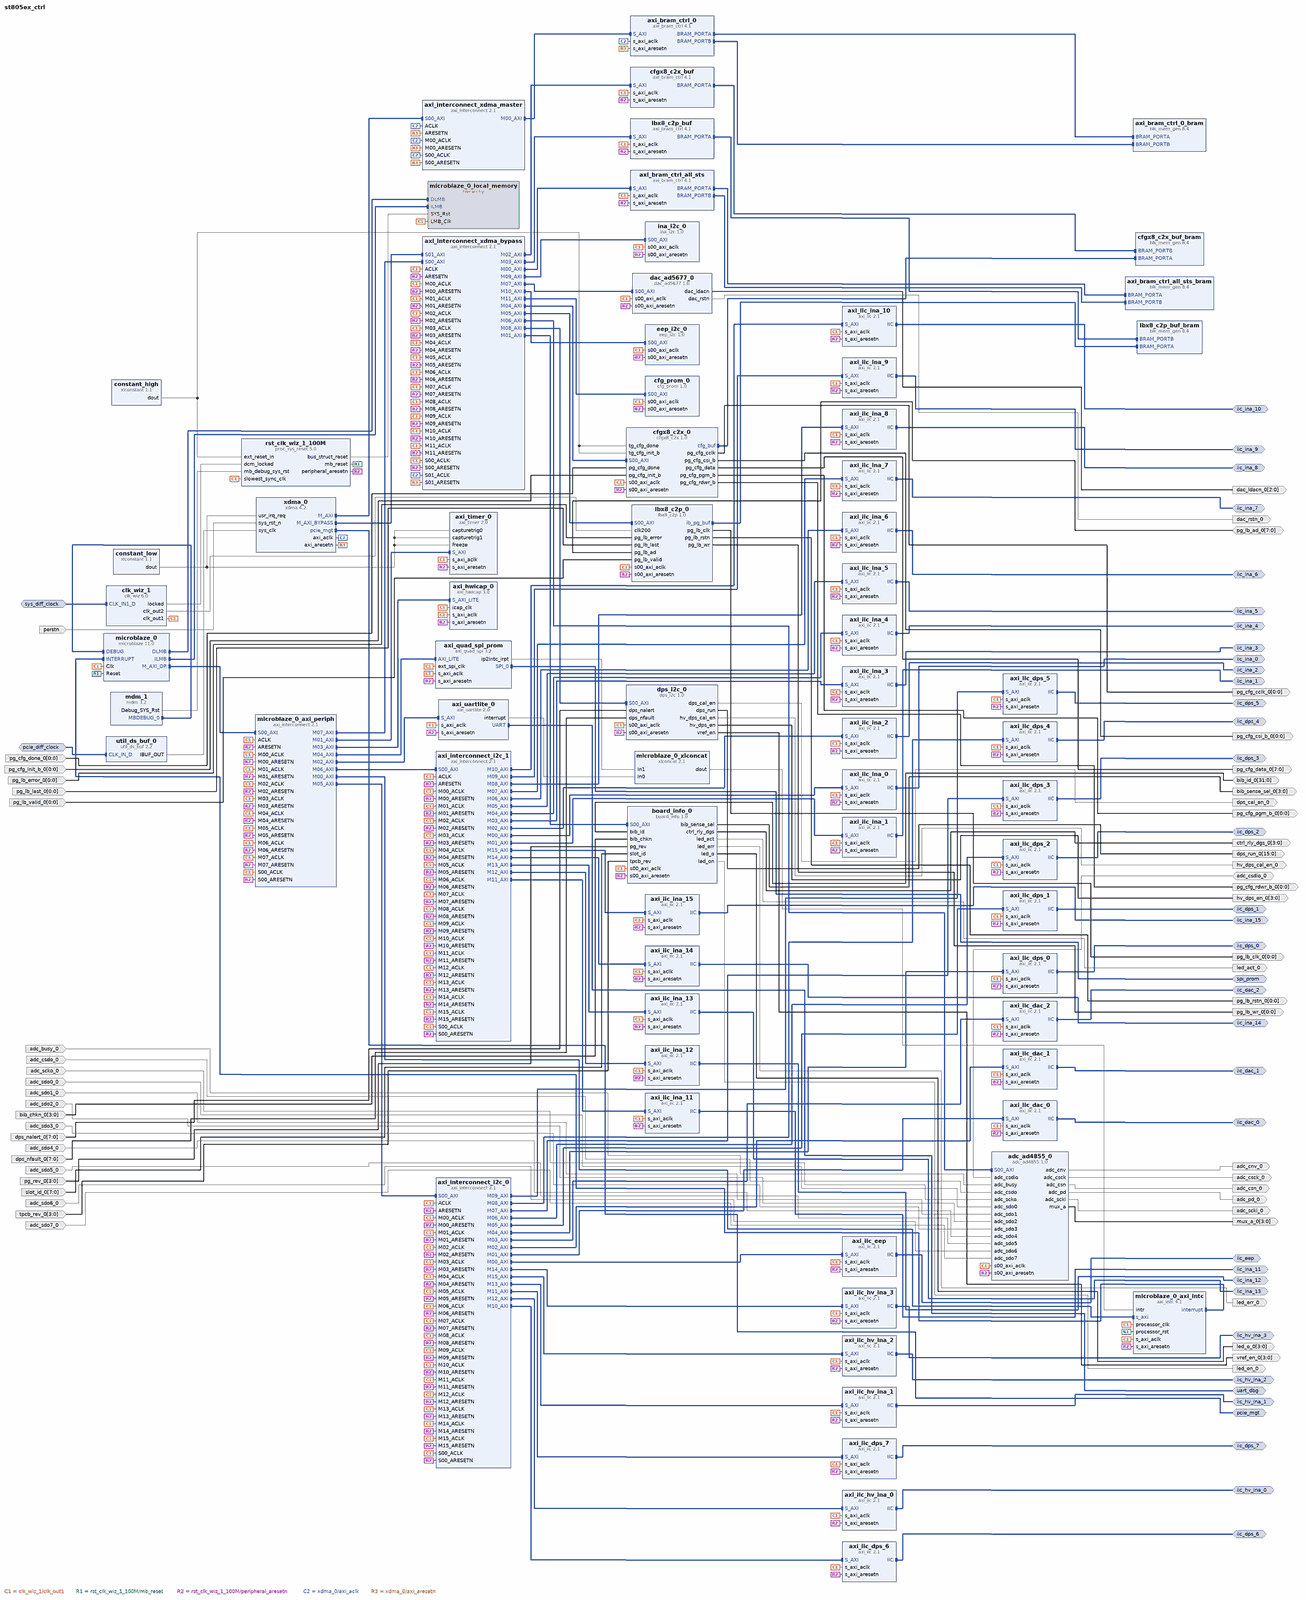
[diagram p0: block diagram of the top level, whole]
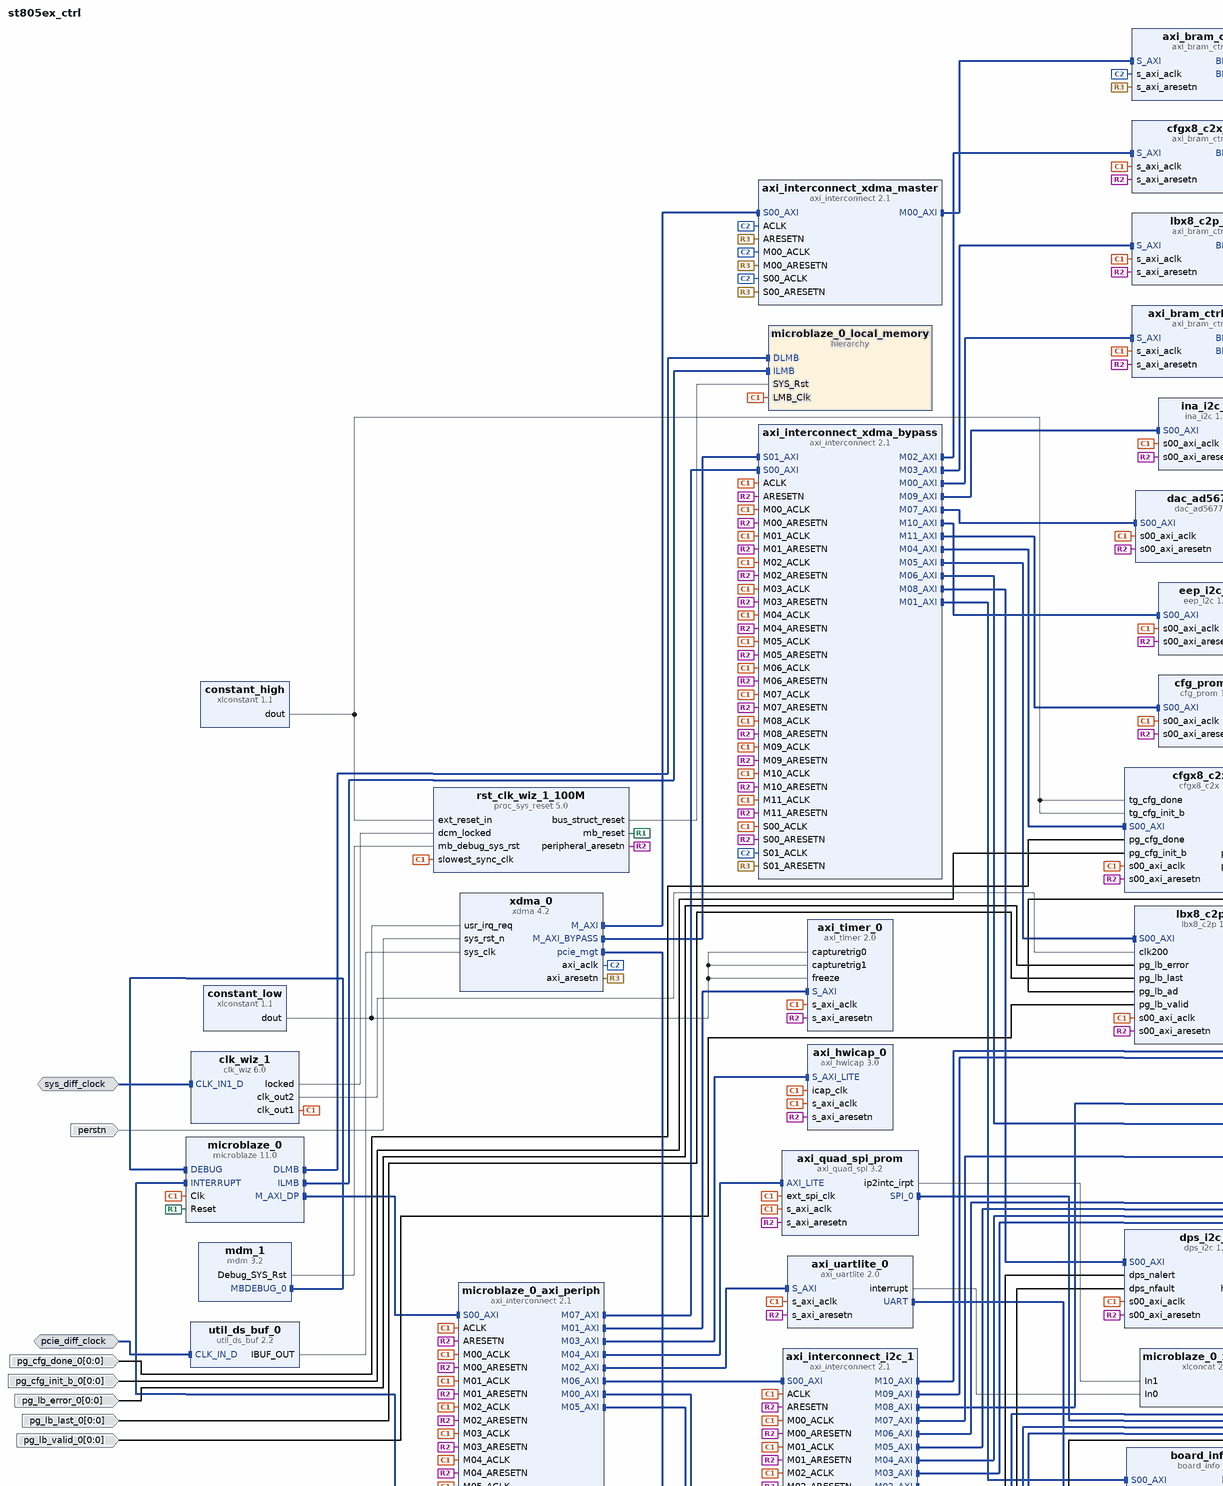
[diagram p1: block diagram of the top level, upper left part]
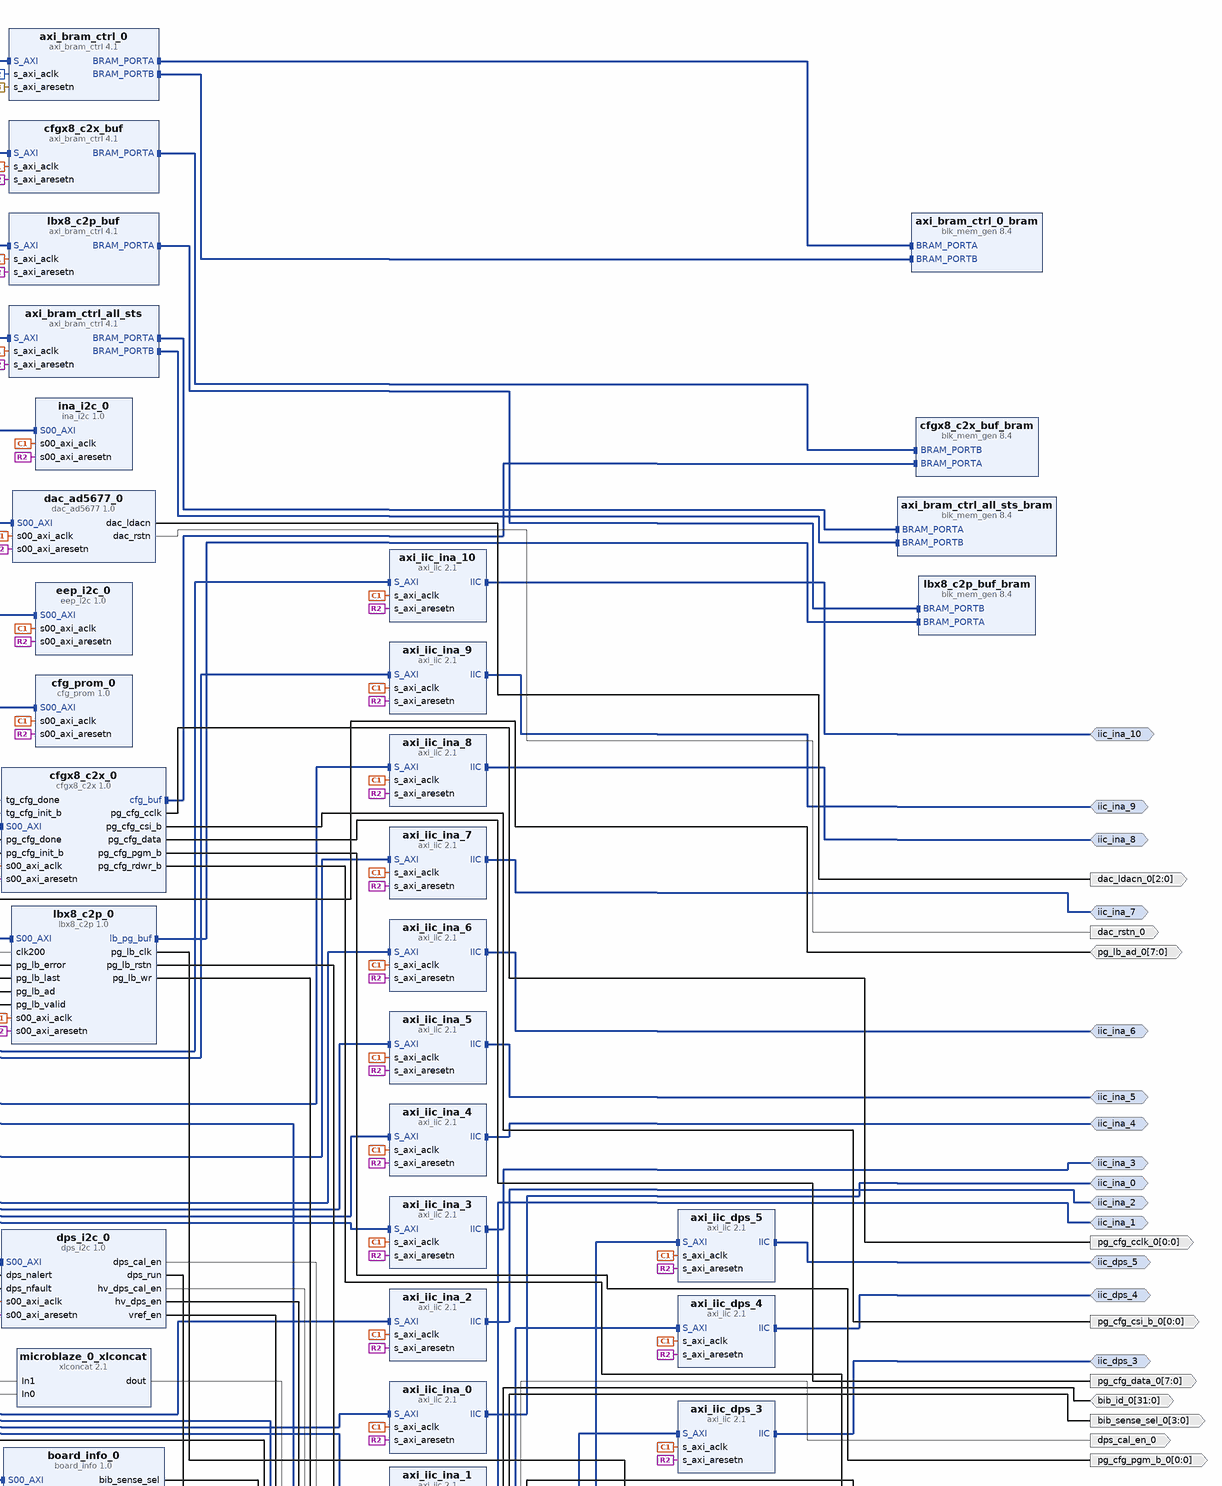
[diagram p2: block diagram of the top level, upper right part]
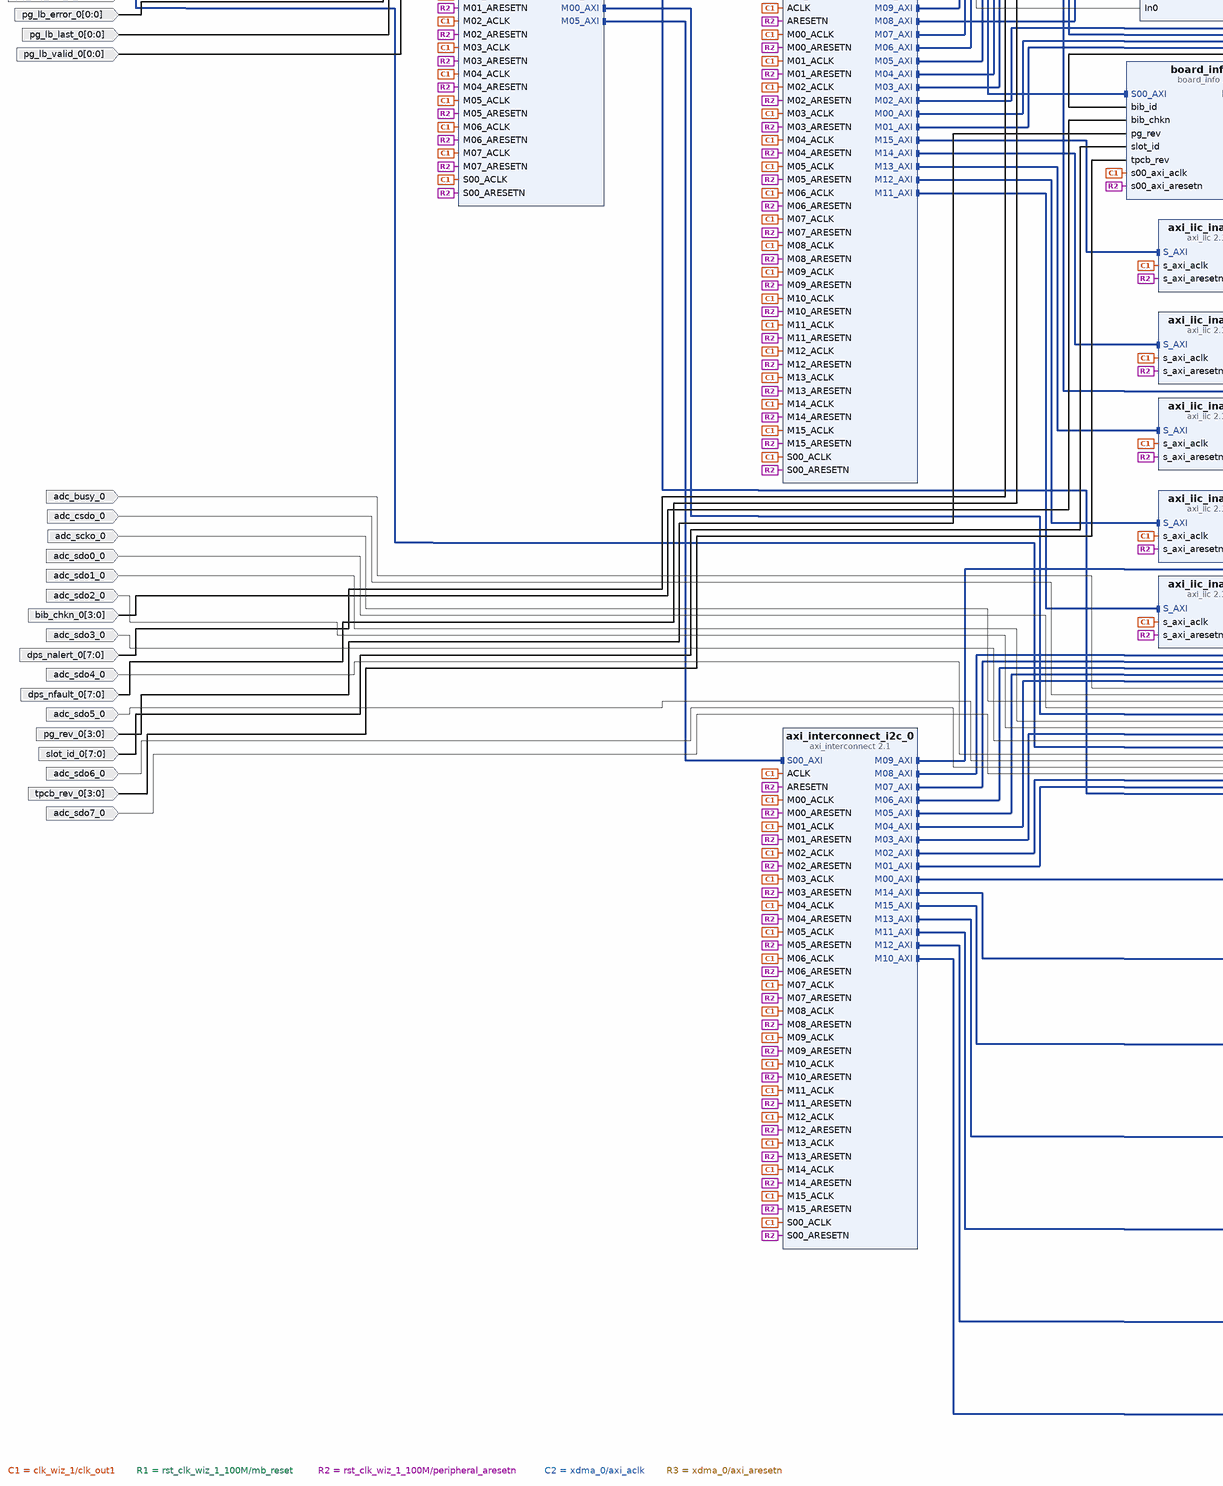
[diagram p3: block diagram of the top level, lower left part]
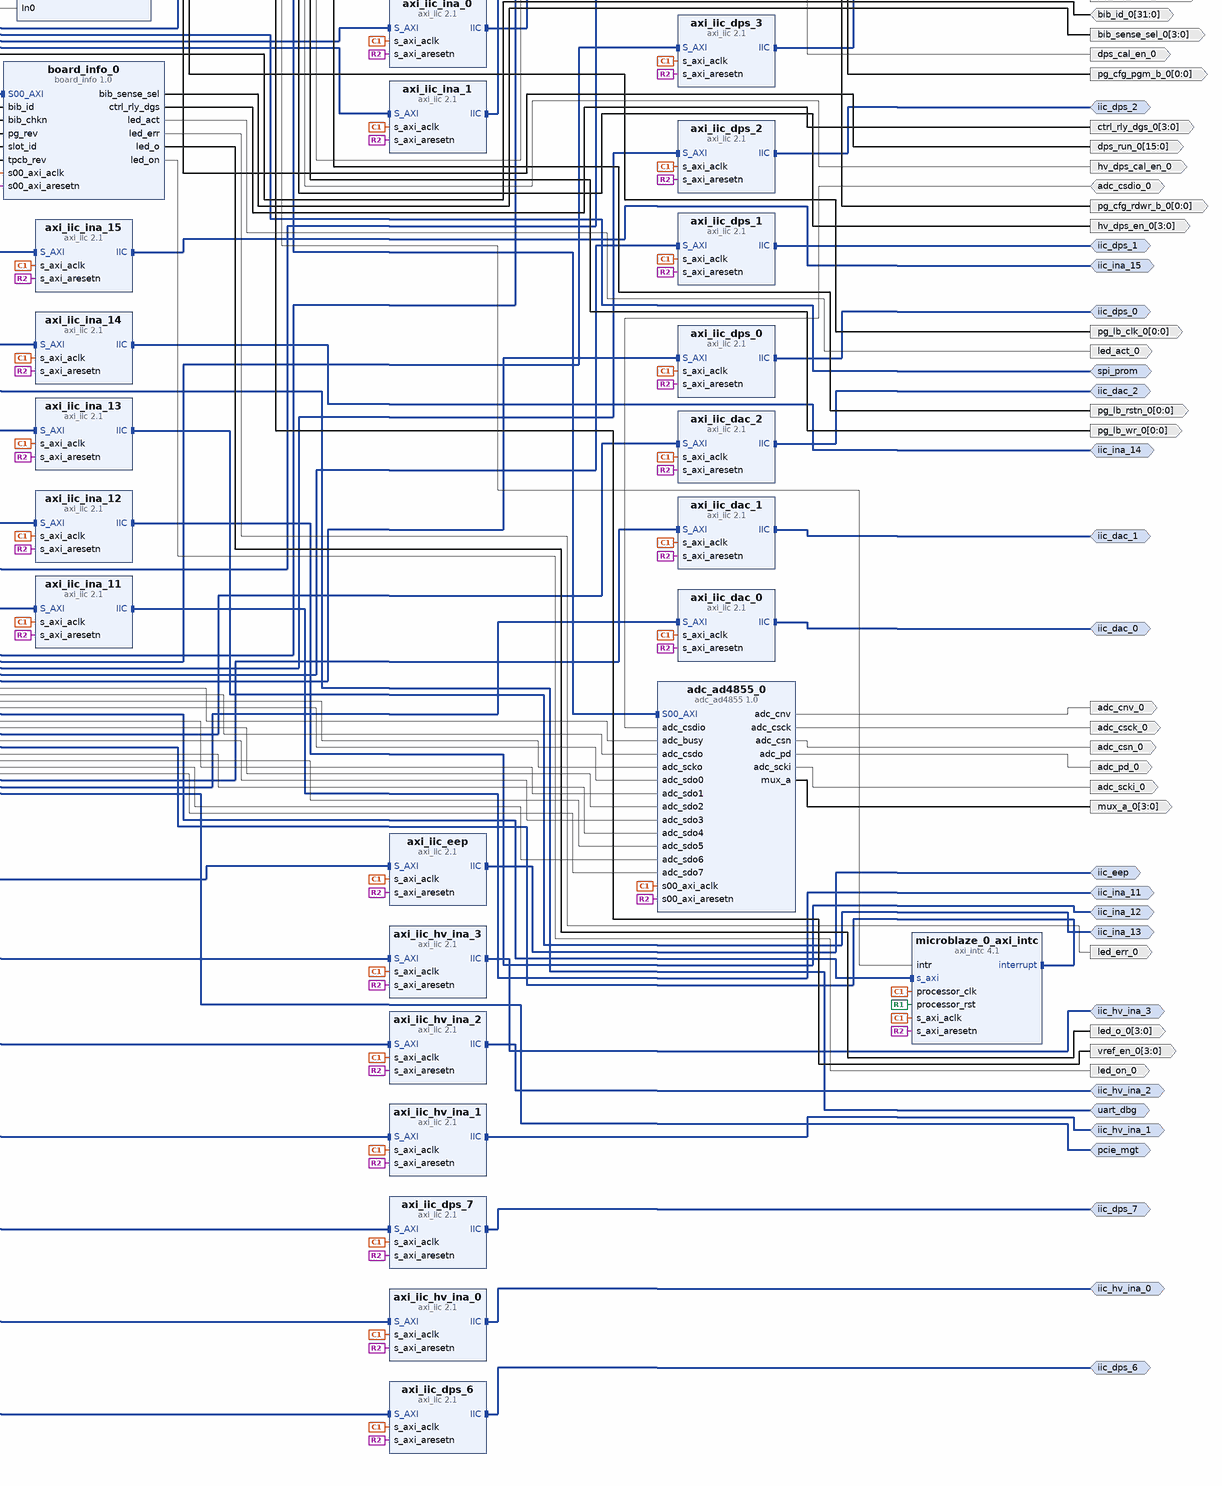
[diagram p4: block diagram of the top level, lower right part]
# Vivado block design st805ex_ctrl, xc7a200tffg1156-2, Vivado 2025.2
create_bd_design st805ex_ctrl

create_bd_intf_port -mode Slave -vlnv xilinx.com:interface:diff_clock_rtl:1.0 sys_diff_clock
create_bd_intf_port -mode Master -vlnv xilinx.com:interface:uart_rtl:1.0 uart_dbg
create_bd_intf_port -mode Master -vlnv xilinx.com:interface:spi_rtl:1.0 spi_prom
create_bd_intf_port -mode Master -vlnv xilinx.com:interface:iic_rtl:1.0 iic_dac_0
create_bd_intf_port -mode Master -vlnv xilinx.com:interface:iic_rtl:1.0 iic_dac_1
create_bd_intf_port -mode Master -vlnv xilinx.com:interface:iic_rtl:1.0 iic_dac_2
create_bd_intf_port -mode Master -vlnv xilinx.com:interface:iic_rtl:1.0 iic_eep
create_bd_intf_port -mode Master -vlnv xilinx.com:interface:iic_rtl:1.0 iic_dps_0
create_bd_intf_port -mode Master -vlnv xilinx.com:interface:iic_rtl:1.0 iic_dps_1
create_bd_intf_port -mode Master -vlnv xilinx.com:interface:iic_rtl:1.0 iic_dps_2
create_bd_intf_port -mode Master -vlnv xilinx.com:interface:iic_rtl:1.0 iic_dps_3
create_bd_intf_port -mode Master -vlnv xilinx.com:interface:iic_rtl:1.0 iic_dps_4
create_bd_intf_port -mode Master -vlnv xilinx.com:interface:iic_rtl:1.0 iic_dps_5
create_bd_intf_port -mode Master -vlnv xilinx.com:interface:iic_rtl:1.0 iic_dps_6
create_bd_intf_port -mode Master -vlnv xilinx.com:interface:iic_rtl:1.0 iic_dps_7
create_bd_intf_port -mode Master -vlnv xilinx.com:interface:iic_rtl:1.0 iic_hv_ina_0
create_bd_intf_port -mode Master -vlnv xilinx.com:interface:iic_rtl:1.0 iic_hv_ina_1
create_bd_intf_port -mode Master -vlnv xilinx.com:interface:iic_rtl:1.0 iic_hv_ina_2
create_bd_intf_port -mode Master -vlnv xilinx.com:interface:iic_rtl:1.0 iic_hv_ina_3
create_bd_intf_port -mode Master -vlnv xilinx.com:interface:iic_rtl:1.0 iic_ina_0
create_bd_intf_port -mode Master -vlnv xilinx.com:interface:iic_rtl:1.0 iic_ina_1
create_bd_intf_port -mode Master -vlnv xilinx.com:interface:iic_rtl:1.0 iic_ina_2
create_bd_intf_port -mode Master -vlnv xilinx.com:interface:iic_rtl:1.0 iic_ina_3
create_bd_intf_port -mode Master -vlnv xilinx.com:interface:iic_rtl:1.0 iic_ina_4
create_bd_intf_port -mode Master -vlnv xilinx.com:interface:iic_rtl:1.0 iic_ina_5
create_bd_intf_port -mode Master -vlnv xilinx.com:interface:iic_rtl:1.0 iic_ina_6
create_bd_intf_port -mode Master -vlnv xilinx.com:interface:iic_rtl:1.0 iic_ina_7
create_bd_intf_port -mode Master -vlnv xilinx.com:interface:iic_rtl:1.0 iic_ina_8
create_bd_intf_port -mode Master -vlnv xilinx.com:interface:iic_rtl:1.0 iic_ina_9
create_bd_intf_port -mode Master -vlnv xilinx.com:interface:iic_rtl:1.0 iic_ina_10
create_bd_intf_port -mode Master -vlnv xilinx.com:interface:iic_rtl:1.0 iic_ina_11
create_bd_intf_port -mode Master -vlnv xilinx.com:interface:iic_rtl:1.0 iic_ina_12
create_bd_intf_port -mode Master -vlnv xilinx.com:interface:iic_rtl:1.0 iic_ina_13
create_bd_intf_port -mode Master -vlnv xilinx.com:interface:iic_rtl:1.0 iic_ina_14
create_bd_intf_port -mode Master -vlnv xilinx.com:interface:iic_rtl:1.0 iic_ina_15
create_bd_intf_port -mode Slave -vlnv xilinx.com:interface:diff_clock_rtl:1.0 pcie_diff_clock
create_bd_intf_port -mode Master -vlnv xilinx.com:interface:pcie_7x_mgt_rtl:1.0 pcie_mgt
create_bd_port -dir I -type rst perstn
create_bd_port -dir I -from 3 -to 0 bib_chkn_0
create_bd_port -dir O -from 3 -to 0 bib_sense_sel_0
create_bd_port -dir O -from 3 -to 0 ctrl_rly_dgs_0
create_bd_port -dir O led_act_0
create_bd_port -dir O led_err_0
create_bd_port -dir O -from 3 -to 0 led_o_0
create_bd_port -dir O led_on_0
create_bd_port -dir I -from 7 -to 0 slot_id_0
create_bd_port -dir I -from 3 -to 0 tpcb_rev_0
create_bd_port -dir IO -from 31 -to 0 bib_id_0
create_bd_port -dir I -from 0 -to 0 pg_cfg_init_b_0
create_bd_port -dir I -from 0 -to 0 pg_cfg_done_0
create_bd_port -dir O -from 0 -to 0 pg_cfg_rdwr_b_0
create_bd_port -dir O -from 0 -to 0 pg_cfg_cclk_0
create_bd_port -dir O -from 0 -to 0 pg_cfg_pgm_b_0
create_bd_port -dir O -from 0 -to 0 pg_cfg_csi_b_0
create_bd_port -dir O -from 7 -to 0 pg_cfg_data_0
create_bd_port -dir O -from 0 -to 0 -type clk pg_lb_clk_0
create_bd_port -dir O -from 0 -to 0 -type rst pg_lb_rstn_0
create_bd_port -dir I -from 0 -to 0 pg_lb_last_0
create_bd_port -dir I -from 0 -to 0 pg_lb_valid_0
create_bd_port -dir I -from 0 -to 0 pg_lb_error_0
create_bd_port -dir O -from 0 -to 0 pg_lb_wr_0
create_bd_port -dir IO -from 7 -to 0 pg_lb_ad_0
create_bd_port -dir I adc_busy_0
create_bd_port -dir O adc_cnv_0
create_bd_port -dir O adc_csck_0
create_bd_port -dir IO adc_csdio_0
create_bd_port -dir I adc_csdo_0
create_bd_port -dir O adc_csn_0
create_bd_port -dir O adc_pd_0
create_bd_port -dir O adc_scki_0
create_bd_port -dir I adc_scko_0
create_bd_port -dir I adc_sdo0_0
create_bd_port -dir I adc_sdo1_0
create_bd_port -dir I adc_sdo2_0
create_bd_port -dir I adc_sdo3_0
create_bd_port -dir I adc_sdo4_0
create_bd_port -dir I adc_sdo5_0
create_bd_port -dir I adc_sdo6_0
create_bd_port -dir I adc_sdo7_0
create_bd_port -dir O -from 3 -to 0 mux_a_0
create_bd_port -dir O -type rst dac_rstn_0
create_bd_port -dir O -from 2 -to 0 dac_ldacn_0
create_bd_port -dir O dps_cal_en_0
create_bd_port -dir I -from 7 -to 0 dps_nalert_0
create_bd_port -dir I -from 7 -to 0 dps_nfault_0
create_bd_port -dir O -from 15 -to 0 dps_run_0
create_bd_port -dir O hv_dps_cal_en_0
create_bd_port -dir O -from 3 -to 0 hv_dps_en_0
create_bd_port -dir O -from 3 -to 0 vref_en_0
create_bd_port -dir I -from 3 -to 0 pg_rev_0

create_bd_cell -type ip -vlnv xilinx.com:ip:microblaze:11.0 microblaze_0
set_property -dict [list \
  CONFIG.C_DEBUG_ENABLED 1 \
  CONFIG.C_D_AXI 1 \
  CONFIG.C_D_LMB 1 \
  CONFIG.C_ENABLE_CONVERSION 0 \
  CONFIG.C_I_LMB 1 \
] [get_bd_cells microblaze_0]
create_bd_cell -type hier microblaze_0_local_memory
create_bd_cell -type ip -vlnv xilinx.com:ip:axi_interconnect:2.1 microblaze_0_axi_periph
set_property -dict {CONFIG.NUM_MI 8 CONFIG.S00_HAS_DATA_FIFO 2 CONFIG.STRATEGY 2} [get_bd_cells microblaze_0_axi_periph]
create_bd_cell -type ip -vlnv xilinx.com:ip:axi_intc:4.1 microblaze_0_axi_intc
set_property -dict {CONFIG.C_HAS_FAST 1} [get_bd_cells microblaze_0_axi_intc]
create_bd_cell -type ip -vlnv xilinx.com:ip:xlconcat:2.1 microblaze_0_xlconcat
create_bd_cell -type ip -vlnv xilinx.com:ip:mdm:3.2 mdm_1
create_bd_cell -type ip -vlnv xilinx.com:ip:clk_wiz:6.0 clk_wiz_1
set_property -dict [list \
  CONFIG.CLKOUT1_DRIVES BUFG \
  CONFIG.CLKOUT1_JITTER 130.958 \
  CONFIG.CLKOUT1_PHASE_ERROR 98.575 \
  CONFIG.CLKOUT2_DRIVES BUFG \
  CONFIG.CLKOUT2_JITTER 114.829 \
  CONFIG.CLKOUT2_PHASE_ERROR 98.575 \
  CONFIG.CLKOUT2_REQUESTED_OUT_FREQ 200.000 \
  CONFIG.CLKOUT2_USED true \
  CONFIG.CLKOUT3_DRIVES BUFG \
  CONFIG.CLKOUT4_DRIVES BUFG \
  CONFIG.CLKOUT5_DRIVES BUFG \
  CONFIG.CLKOUT6_DRIVES BUFG \
  CONFIG.CLKOUT7_DRIVES BUFG \
  CONFIG.MMCM_BANDWIDTH OPTIMIZED \
  CONFIG.MMCM_CLKFBOUT_MULT_F 10 \
  CONFIG.MMCM_CLKOUT0_DIVIDE_F 10 \
  CONFIG.MMCM_CLKOUT1_DIVIDE 5 \
  CONFIG.MMCM_COMPENSATION ZHOLD \
  CONFIG.NUM_OUT_CLKS 2 \
  CONFIG.PRIMITIVE PLL \
  CONFIG.PRIM_IN_FREQ 100.000 \
  CONFIG.PRIM_SOURCE Differential_clock_capable_pin \
  CONFIG.USE_RESET false \
] [get_bd_cells clk_wiz_1]
create_bd_cell -type ip -vlnv xilinx.com:ip:proc_sys_reset:5.0 rst_clk_wiz_1_100M
create_bd_cell -type ip -vlnv xilinx.com:ip:xlconstant:1.1 constant_high
create_bd_cell -type ip -vlnv xilinx.com:ip:axi_uartlite:2.0 axi_uartlite_0
set_property -dict {CONFIG.C_BAUDRATE 115200} [get_bd_cells axi_uartlite_0]
create_bd_cell -type ip -vlnv xilinx.com:ip:axi_timer:2.0 axi_timer_0
create_bd_cell -type ip -vlnv xilinx.com:ip:xlconstant:1.1 constant_low
set_property -dict {CONFIG.CONST_VAL 0} [get_bd_cells constant_low]
create_bd_cell -type ip -vlnv xilinx.com:ip:axi_hwicap:3.0 axi_hwicap_0
create_bd_cell -type ip -vlnv xilinx.com:ip:axi_quad_spi:3.2 axi_quad_spi_prom
set_property -dict {CONFIG.C_FIFO_DEPTH 256 CONFIG.C_SPI_MEMORY 2 CONFIG.C_SPI_MODE 2} [get_bd_cells axi_quad_spi_prom]
create_bd_cell -type ip -vlnv xilinx.com:ip:axi_interconnect:2.1 axi_interconnect_i2c_0
set_property -dict {CONFIG.NUM_MI 16 CONFIG.S00_HAS_DATA_FIFO 2 CONFIG.STRATEGY 2} [get_bd_cells axi_interconnect_i2c_0]
create_bd_cell -type ip -vlnv xilinx.com:ip:axi_iic:2.1 axi_iic_dac_0
set_property -dict [list \
  CONFIG.C_SCL_INERTIAL_DELAY 5 \
  CONFIG.C_SDA_INERTIAL_DELAY 5 \
  CONFIG.IIC_FREQ_KHZ 400 \
] [get_bd_cells axi_iic_dac_0]
create_bd_cell -type ip -vlnv xilinx.com:ip:axi_iic:2.1 axi_iic_dac_1
set_property -dict [list \
  CONFIG.C_SCL_INERTIAL_DELAY 5 \
  CONFIG.C_SDA_INERTIAL_DELAY 5 \
  CONFIG.IIC_FREQ_KHZ 400 \
] [get_bd_cells axi_iic_dac_1]
create_bd_cell -type ip -vlnv xilinx.com:ip:axi_iic:2.1 axi_iic_dac_2
set_property -dict [list \
  CONFIG.C_SCL_INERTIAL_DELAY 5 \
  CONFIG.C_SDA_INERTIAL_DELAY 5 \
  CONFIG.IIC_FREQ_KHZ 400 \
] [get_bd_cells axi_iic_dac_2]
create_bd_cell -type ip -vlnv xilinx.com:ip:axi_iic:2.1 axi_iic_eep
set_property -dict [list \
  CONFIG.C_SCL_INERTIAL_DELAY 5 \
  CONFIG.C_SDA_INERTIAL_DELAY 5 \
  CONFIG.IIC_FREQ_KHZ 400 \
] [get_bd_cells axi_iic_eep]
create_bd_cell -type ip -vlnv xilinx.com:ip:axi_iic:2.1 axi_iic_dps_0
set_property -dict [list \
  CONFIG.C_SCL_INERTIAL_DELAY 5 \
  CONFIG.C_SDA_INERTIAL_DELAY 5 \
  CONFIG.IIC_FREQ_KHZ 400 \
] [get_bd_cells axi_iic_dps_0]
create_bd_cell -type ip -vlnv xilinx.com:ip:axi_iic:2.1 axi_iic_dps_1
set_property -dict [list \
  CONFIG.C_SCL_INERTIAL_DELAY 5 \
  CONFIG.C_SDA_INERTIAL_DELAY 5 \
  CONFIG.IIC_FREQ_KHZ 400 \
] [get_bd_cells axi_iic_dps_1]
create_bd_cell -type ip -vlnv xilinx.com:ip:axi_iic:2.1 axi_iic_dps_2
set_property -dict [list \
  CONFIG.C_SCL_INERTIAL_DELAY 5 \
  CONFIG.C_SDA_INERTIAL_DELAY 5 \
  CONFIG.IIC_FREQ_KHZ 400 \
] [get_bd_cells axi_iic_dps_2]
create_bd_cell -type ip -vlnv xilinx.com:ip:axi_iic:2.1 axi_iic_dps_3
set_property -dict [list \
  CONFIG.C_SCL_INERTIAL_DELAY 5 \
  CONFIG.C_SDA_INERTIAL_DELAY 5 \
  CONFIG.IIC_FREQ_KHZ 400 \
] [get_bd_cells axi_iic_dps_3]
create_bd_cell -type ip -vlnv xilinx.com:ip:axi_iic:2.1 axi_iic_dps_4
set_property -dict [list \
  CONFIG.C_SCL_INERTIAL_DELAY 5 \
  CONFIG.C_SDA_INERTIAL_DELAY 5 \
  CONFIG.IIC_FREQ_KHZ 400 \
] [get_bd_cells axi_iic_dps_4]
create_bd_cell -type ip -vlnv xilinx.com:ip:axi_iic:2.1 axi_iic_dps_5
set_property -dict [list \
  CONFIG.C_SCL_INERTIAL_DELAY 5 \
  CONFIG.C_SDA_INERTIAL_DELAY 5 \
  CONFIG.IIC_FREQ_KHZ 400 \
] [get_bd_cells axi_iic_dps_5]
create_bd_cell -type ip -vlnv xilinx.com:ip:axi_iic:2.1 axi_iic_dps_6
set_property -dict [list \
  CONFIG.C_SCL_INERTIAL_DELAY 5 \
  CONFIG.C_SDA_INERTIAL_DELAY 5 \
  CONFIG.IIC_FREQ_KHZ 400 \
] [get_bd_cells axi_iic_dps_6]
create_bd_cell -type ip -vlnv xilinx.com:ip:axi_iic:2.1 axi_iic_dps_7
set_property -dict [list \
  CONFIG.C_SCL_INERTIAL_DELAY 5 \
  CONFIG.C_SDA_INERTIAL_DELAY 5 \
  CONFIG.IIC_FREQ_KHZ 400 \
] [get_bd_cells axi_iic_dps_7]
create_bd_cell -type ip -vlnv xilinx.com:ip:axi_iic:2.1 axi_iic_hv_ina_0
set_property -dict [list \
  CONFIG.C_SCL_INERTIAL_DELAY 5 \
  CONFIG.C_SDA_INERTIAL_DELAY 5 \
  CONFIG.IIC_FREQ_KHZ 400 \
] [get_bd_cells axi_iic_hv_ina_0]
create_bd_cell -type ip -vlnv xilinx.com:ip:axi_iic:2.1 axi_iic_hv_ina_1
set_property -dict [list \
  CONFIG.C_SCL_INERTIAL_DELAY 5 \
  CONFIG.C_SDA_INERTIAL_DELAY 5 \
  CONFIG.IIC_FREQ_KHZ 400 \
] [get_bd_cells axi_iic_hv_ina_1]
create_bd_cell -type ip -vlnv xilinx.com:ip:axi_iic:2.1 axi_iic_hv_ina_2
set_property -dict [list \
  CONFIG.C_SCL_INERTIAL_DELAY 5 \
  CONFIG.C_SDA_INERTIAL_DELAY 5 \
  CONFIG.IIC_FREQ_KHZ 400 \
] [get_bd_cells axi_iic_hv_ina_2]
create_bd_cell -type ip -vlnv xilinx.com:ip:axi_iic:2.1 axi_iic_hv_ina_3
set_property -dict [list \
  CONFIG.C_SCL_INERTIAL_DELAY 5 \
  CONFIG.C_SDA_INERTIAL_DELAY 5 \
  CONFIG.IIC_FREQ_KHZ 400 \
] [get_bd_cells axi_iic_hv_ina_3]
create_bd_cell -type ip -vlnv xilinx.com:ip:axi_interconnect:2.1 axi_interconnect_i2c_1
set_property -dict {CONFIG.NUM_MI 16 CONFIG.S00_HAS_DATA_FIFO 2 CONFIG.STRATEGY 2} [get_bd_cells axi_interconnect_i2c_1]
create_bd_cell -type ip -vlnv xilinx.com:ip:axi_iic:2.1 axi_iic_ina_0
set_property -dict [list \
  CONFIG.C_SCL_INERTIAL_DELAY 5 \
  CONFIG.C_SDA_INERTIAL_DELAY 5 \
  CONFIG.IIC_FREQ_KHZ 400 \
] [get_bd_cells axi_iic_ina_0]
create_bd_cell -type ip -vlnv xilinx.com:ip:axi_iic:2.1 axi_iic_ina_1
set_property -dict [list \
  CONFIG.C_SCL_INERTIAL_DELAY 5 \
  CONFIG.C_SDA_INERTIAL_DELAY 5 \
  CONFIG.IIC_FREQ_KHZ 400 \
] [get_bd_cells axi_iic_ina_1]
create_bd_cell -type ip -vlnv xilinx.com:ip:axi_iic:2.1 axi_iic_ina_2
set_property -dict [list \
  CONFIG.C_SCL_INERTIAL_DELAY 5 \
  CONFIG.C_SDA_INERTIAL_DELAY 5 \
  CONFIG.IIC_FREQ_KHZ 400 \
] [get_bd_cells axi_iic_ina_2]
create_bd_cell -type ip -vlnv xilinx.com:ip:axi_iic:2.1 axi_iic_ina_3
set_property -dict [list \
  CONFIG.C_SCL_INERTIAL_DELAY 5 \
  CONFIG.C_SDA_INERTIAL_DELAY 5 \
  CONFIG.IIC_FREQ_KHZ 400 \
] [get_bd_cells axi_iic_ina_3]
create_bd_cell -type ip -vlnv xilinx.com:ip:axi_iic:2.1 axi_iic_ina_4
set_property -dict [list \
  CONFIG.C_SCL_INERTIAL_DELAY 5 \
  CONFIG.C_SDA_INERTIAL_DELAY 5 \
  CONFIG.IIC_FREQ_KHZ 400 \
] [get_bd_cells axi_iic_ina_4]
create_bd_cell -type ip -vlnv xilinx.com:ip:axi_iic:2.1 axi_iic_ina_5
set_property -dict [list \
  CONFIG.C_SCL_INERTIAL_DELAY 5 \
  CONFIG.C_SDA_INERTIAL_DELAY 5 \
  CONFIG.IIC_FREQ_KHZ 400 \
] [get_bd_cells axi_iic_ina_5]
create_bd_cell -type ip -vlnv xilinx.com:ip:axi_iic:2.1 axi_iic_ina_6
set_property -dict [list \
  CONFIG.C_SCL_INERTIAL_DELAY 5 \
  CONFIG.C_SDA_INERTIAL_DELAY 5 \
  CONFIG.IIC_FREQ_KHZ 400 \
] [get_bd_cells axi_iic_ina_6]
create_bd_cell -type ip -vlnv xilinx.com:ip:axi_iic:2.1 axi_iic_ina_7
set_property -dict [list \
  CONFIG.C_SCL_INERTIAL_DELAY 5 \
  CONFIG.C_SDA_INERTIAL_DELAY 5 \
  CONFIG.IIC_FREQ_KHZ 400 \
] [get_bd_cells axi_iic_ina_7]
create_bd_cell -type ip -vlnv xilinx.com:ip:axi_iic:2.1 axi_iic_ina_8
set_property -dict [list \
  CONFIG.C_SCL_INERTIAL_DELAY 5 \
  CONFIG.C_SDA_INERTIAL_DELAY 5 \
  CONFIG.IIC_FREQ_KHZ 400 \
] [get_bd_cells axi_iic_ina_8]
create_bd_cell -type ip -vlnv xilinx.com:ip:axi_iic:2.1 axi_iic_ina_9
set_property -dict [list \
  CONFIG.C_SCL_INERTIAL_DELAY 5 \
  CONFIG.C_SDA_INERTIAL_DELAY 5 \
  CONFIG.IIC_FREQ_KHZ 400 \
] [get_bd_cells axi_iic_ina_9]
create_bd_cell -type ip -vlnv xilinx.com:ip:axi_iic:2.1 axi_iic_ina_10
set_property -dict [list \
  CONFIG.C_SCL_INERTIAL_DELAY 5 \
  CONFIG.C_SDA_INERTIAL_DELAY 5 \
  CONFIG.IIC_FREQ_KHZ 400 \
] [get_bd_cells axi_iic_ina_10]
create_bd_cell -type ip -vlnv xilinx.com:ip:axi_iic:2.1 axi_iic_ina_11
set_property -dict [list \
  CONFIG.C_SCL_INERTIAL_DELAY 5 \
  CONFIG.C_SDA_INERTIAL_DELAY 5 \
  CONFIG.IIC_FREQ_KHZ 400 \
] [get_bd_cells axi_iic_ina_11]
create_bd_cell -type ip -vlnv xilinx.com:ip:axi_iic:2.1 axi_iic_ina_12
set_property -dict [list \
  CONFIG.C_SCL_INERTIAL_DELAY 5 \
  CONFIG.C_SDA_INERTIAL_DELAY 5 \
  CONFIG.IIC_FREQ_KHZ 400 \
] [get_bd_cells axi_iic_ina_12]
create_bd_cell -type ip -vlnv xilinx.com:ip:axi_iic:2.1 axi_iic_ina_13
set_property -dict [list \
  CONFIG.C_SCL_INERTIAL_DELAY 5 \
  CONFIG.C_SDA_INERTIAL_DELAY 5 \
  CONFIG.IIC_FREQ_KHZ 400 \
] [get_bd_cells axi_iic_ina_13]
create_bd_cell -type ip -vlnv xilinx.com:ip:axi_iic:2.1 axi_iic_ina_14
set_property -dict [list \
  CONFIG.C_SCL_INERTIAL_DELAY 5 \
  CONFIG.C_SDA_INERTIAL_DELAY 5 \
  CONFIG.IIC_FREQ_KHZ 400 \
] [get_bd_cells axi_iic_ina_14]
create_bd_cell -type ip -vlnv xilinx.com:ip:axi_iic:2.1 axi_iic_ina_15
set_property -dict [list \
  CONFIG.C_SCL_INERTIAL_DELAY 5 \
  CONFIG.C_SDA_INERTIAL_DELAY 5 \
  CONFIG.IIC_FREQ_KHZ 400 \
] [get_bd_cells axi_iic_ina_15]
create_bd_cell -type ip -vlnv xilinx.com:ip:xdma:4.2 xdma_0
set_property -dict [list \
  CONFIG.PF0_DEVICE_ID_mqdma 9021 \
  CONFIG.PF2_DEVICE_ID_mqdma 9221 \
  CONFIG.PF3_DEVICE_ID_mqdma 9321 \
  CONFIG.Shared_Logic_Both_7xG2 true \
  CONFIG.axi_bypass_64bit_en true \
  CONFIG.axist_bypass_en true \
  CONFIG.axist_bypass_size 16 \
  CONFIG.axisten_freq 125 \
  CONFIG.cfg_mgmt_if false \
  CONFIG.enable_gtwizard false \
  CONFIG.mode_selection Advanced \
  CONFIG.pciebar2axibar_axist_bypass 0x00000000C0000000 \
  CONFIG.pf0_base_class_menu Memory_controller \
  CONFIG.pf0_class_code_base 05 \
  CONFIG.pf0_class_code_interface 00 \
  CONFIG.pf0_class_code_sub 80 \
  CONFIG.pf0_device_id 7021 \
  CONFIG.pf0_interrupt_pin NONE \
  CONFIG.pf0_msi_enabled false \
  CONFIG.pf0_sub_class_interface_menu Other_memory_controller \
  CONFIG.pl_link_cap_max_link_speed 5.0_GT/s \
  CONFIG.plltype QPLL1 \
  CONFIG.xdma_pcie_64bit_en true \
  CONFIG.xdma_rnum_chnl 2 \
  CONFIG.xdma_wnum_chnl 2 \
] [get_bd_cells xdma_0]
create_bd_cell -type ip -vlnv xilinx.com:ip:util_ds_buf:2.2 util_ds_buf_0
set_property -dict {CONFIG.C_BUF_TYPE IBUFDSGTE} [get_bd_cells util_ds_buf_0]
create_bd_cell -type ip -vlnv xilinx.com:ip:axi_interconnect:2.1 axi_interconnect_xdma_bypass
set_property -dict [list \
  CONFIG.NUM_MI 12 \
  CONFIG.NUM_SI 2 \
  CONFIG.S00_HAS_DATA_FIFO 2 \
  CONFIG.S01_HAS_DATA_FIFO 2 \
  CONFIG.STRATEGY 2 \
] [get_bd_cells axi_interconnect_xdma_bypass]
create_bd_cell -type ip -vlnv xilinx.com:ip:axi_interconnect:2.1 axi_interconnect_xdma_master
set_property -dict [list \
  CONFIG.NUM_MI 1 \
  CONFIG.NUM_SI 1 \
  CONFIG.S00_HAS_DATA_FIFO 2 \
  CONFIG.S01_HAS_DATA_FIFO 2 \
  CONFIG.STRATEGY 0 \
] [get_bd_cells axi_interconnect_xdma_master]
create_bd_cell -type ip -vlnv xilinx.com:ip:axi_bram_ctrl:4.1 axi_bram_ctrl_0
create_bd_cell -type ip -vlnv xilinx.com:ip:blk_mem_gen:8.4 axi_bram_ctrl_0_bram
set_property -dict [list \
  CONFIG.Enable_B Use_ENB_Pin \
  CONFIG.Memory_Type True_Dual_Port_RAM \
  CONFIG.Port_B_Clock 100 \
  CONFIG.Port_B_Enable_Rate 100 \
  CONFIG.Port_B_Write_Rate 50 \
  CONFIG.Use_RSTB_Pin true \
] [get_bd_cells axi_bram_ctrl_0_bram]
create_bd_cell -type ip -vlnv xilinx.com:user:board_info:1.0 board_info_0
create_bd_cell -type ip -vlnv xilinx.com:user:cfgx8_c2x:1.0 cfgx8_c2x_0
create_bd_cell -type ip -vlnv xilinx.com:ip:axi_bram_ctrl:4.1 cfgx8_c2x_buf
set_property -dict {CONFIG.SINGLE_PORT_BRAM 1} [get_bd_cells cfgx8_c2x_buf]
create_bd_cell -type ip -vlnv xilinx.com:ip:axi_bram_ctrl:4.1 lbx8_c2p_buf
set_property -dict {CONFIG.SINGLE_PORT_BRAM 1} [get_bd_cells lbx8_c2p_buf]
create_bd_cell -type ip -vlnv xilinx.com:ip:blk_mem_gen:8.4 cfgx8_c2x_buf_bram
set_property -dict [list \
  CONFIG.Enable_B Use_ENB_Pin \
  CONFIG.Memory_Type True_Dual_Port_RAM \
  CONFIG.Port_B_Clock 100 \
  CONFIG.Port_B_Enable_Rate 100 \
  CONFIG.Port_B_Write_Rate 50 \
  CONFIG.Use_RSTB_Pin true \
] [get_bd_cells cfgx8_c2x_buf_bram]
create_bd_cell -type ip -vlnv xilinx.com:ip:blk_mem_gen:8.4 lbx8_c2p_buf_bram
set_property -dict [list \
  CONFIG.Enable_B Use_ENB_Pin \
  CONFIG.Memory_Type True_Dual_Port_RAM \
  CONFIG.Port_B_Clock 100 \
  CONFIG.Port_B_Enable_Rate 100 \
  CONFIG.Port_B_Write_Rate 50 \
  CONFIG.Use_RSTB_Pin true \
] [get_bd_cells lbx8_c2p_buf_bram]
create_bd_cell -type ip -vlnv xilinx.com:user:lbx8_c2p:1.0 lbx8_c2p_0
create_bd_cell -type ip -vlnv xilinx.com:user:adc_ad4855:1.0 adc_ad4855_0
create_bd_cell -type ip -vlnv xilinx.com:user:dac_ad5677:1.0 dac_ad5677_0
create_bd_cell -type ip -vlnv xilinx.com:user:dps_i2c:1.0 dps_i2c_0
create_bd_cell -type ip -vlnv xilinx.com:user:ina_i2c:1.0 ina_i2c_0
create_bd_cell -type ip -vlnv xilinx.com:user:eep_i2c:1.0 eep_i2c_0
create_bd_cell -type ip -vlnv xilinx.com:user:cfg_prom:1.0 cfg_prom_0
create_bd_cell -type ip -vlnv xilinx.com:ip:axi_bram_ctrl:4.1 axi_bram_ctrl_all_sts
create_bd_cell -type ip -vlnv xilinx.com:ip:blk_mem_gen:8.4 axi_bram_ctrl_all_sts_bram
set_property -dict {CONFIG.Memory_Type True_Dual_Port_RAM} [get_bd_cells axi_bram_ctrl_all_sts_bram]

# ---- hierarchy /microblaze_0_local_memory ----
current_bd_instance /microblaze_0_local_memory
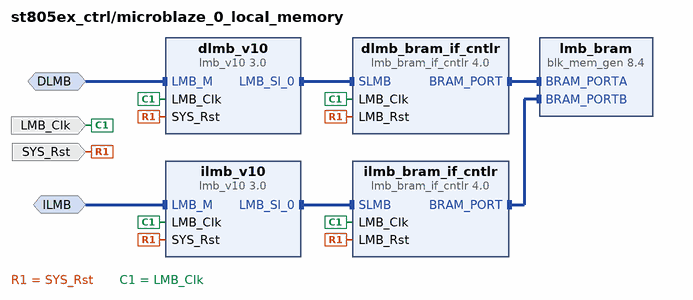
[diagram p5: block diagram inside /microblaze_0_local_memory]
create_bd_intf_pin -mode MirroredMaster -vlnv xilinx.com:interface:lmb_rtl:1.0 DLMB
create_bd_intf_pin -mode MirroredMaster -vlnv xilinx.com:interface:lmb_rtl:1.0 ILMB
create_bd_pin -dir I -type clk LMB_Clk
create_bd_pin -dir I -type rst SYS_Rst

create_bd_cell -type ip -vlnv xilinx.com:ip:lmb_v10:3.0 dlmb_v10
create_bd_cell -type ip -vlnv xilinx.com:ip:lmb_v10:3.0 ilmb_v10
create_bd_cell -type ip -vlnv xilinx.com:ip:lmb_bram_if_cntlr:4.0 dlmb_bram_if_cntlr
set_property -dict {CONFIG.C_ECC 0} [get_bd_cells dlmb_bram_if_cntlr]
create_bd_cell -type ip -vlnv xilinx.com:ip:lmb_bram_if_cntlr:4.0 ilmb_bram_if_cntlr
set_property -dict {CONFIG.C_ECC 0} [get_bd_cells ilmb_bram_if_cntlr]
create_bd_cell -type ip -vlnv xilinx.com:ip:blk_mem_gen:8.4 lmb_bram
set_property -dict [list \
  CONFIG.Enable_B Use_ENB_Pin \
  CONFIG.Memory_Type True_Dual_Port_RAM \
  CONFIG.Port_B_Clock 100 \
  CONFIG.Port_B_Enable_Rate 100 \
  CONFIG.Port_B_Write_Rate 50 \
  CONFIG.Use_RSTB_Pin true \
  CONFIG.use_bram_block BRAM_Controller \
] [get_bd_cells lmb_bram]

# ---- connections ----

current_bd_instance /microblaze_0_local_memory
connect_bd_intf_net -intf_net microblaze_0_dlmb [get_bd_intf_pins dlmb_v10/LMB_M] [get_bd_intf_pins DLMB]
connect_bd_intf_net -intf_net microblaze_0_dlmb_bus [get_bd_intf_pins dlmb_v10/LMB_Sl_0] [get_bd_intf_pins dlmb_bram_if_cntlr/SLMB]
connect_bd_intf_net -intf_net microblaze_0_dlmb_cntlr [get_bd_intf_pins dlmb_bram_if_cntlr/BRAM_PORT] [get_bd_intf_pins lmb_bram/BRAM_PORTA]
connect_bd_intf_net -intf_net microblaze_0_ilmb [get_bd_intf_pins ilmb_v10/LMB_M] [get_bd_intf_pins ILMB]
connect_bd_intf_net -intf_net microblaze_0_ilmb_bus [get_bd_intf_pins ilmb_v10/LMB_Sl_0] [get_bd_intf_pins ilmb_bram_if_cntlr/SLMB]
connect_bd_intf_net -intf_net microblaze_0_ilmb_cntlr [get_bd_intf_pins ilmb_bram_if_cntlr/BRAM_PORT] [get_bd_intf_pins lmb_bram/BRAM_PORTB]
connect_bd_net [get_bd_pins SYS_Rst] \
  [get_bd_pins dlmb_bram_if_cntlr/LMB_Rst] [get_bd_pins dlmb_v10/SYS_Rst] [get_bd_pins ilmb_bram_if_cntlr/LMB_Rst] \
  [get_bd_pins ilmb_v10/SYS_Rst]
connect_bd_net -net microblaze_0_Clk [get_bd_pins LMB_Clk] \
  [get_bd_pins dlmb_bram_if_cntlr/LMB_Clk] [get_bd_pins dlmb_v10/LMB_Clk] [get_bd_pins ilmb_bram_if_cntlr/LMB_Clk] \
  [get_bd_pins ilmb_v10/LMB_Clk]
set_property HDL_ATTRIBUTE.BMM_INFO_ADDRESS_SPACE {byte  0x00000000 32 > st805ex_ctrl microblaze_0_local_memory/lmb_bram} [get_bd_cells dlmb_bram_if_cntlr]
set_property HDL_ATTRIBUTE.KEEP_HIERARCHY yes [get_bd_cells dlmb_bram_if_cntlr]

current_bd_instance /
connect_bd_intf_net -intf_net CLK_IN1_D_0_1 [get_bd_intf_ports sys_diff_clock] [get_bd_intf_pins clk_wiz_1/CLK_IN1_D]
connect_bd_intf_net -intf_net CLK_IN_D_0_1 [get_bd_intf_ports pcie_diff_clock] [get_bd_intf_pins util_ds_buf_0/CLK_IN_D]
connect_bd_intf_net [get_bd_intf_pins axi_bram_ctrl_0_bram/BRAM_PORTA] [get_bd_intf_pins axi_bram_ctrl_0/BRAM_PORTA]
connect_bd_intf_net [get_bd_intf_pins axi_bram_ctrl_0_bram/BRAM_PORTB] [get_bd_intf_pins axi_bram_ctrl_0/BRAM_PORTB]
connect_bd_intf_net [get_bd_intf_pins axi_bram_ctrl_all_sts_bram/BRAM_PORTA] [get_bd_intf_pins axi_bram_ctrl_all_sts/BRAM_PORTA]
connect_bd_intf_net [get_bd_intf_pins axi_bram_ctrl_all_sts_bram/BRAM_PORTB] [get_bd_intf_pins axi_bram_ctrl_all_sts/BRAM_PORTB]
connect_bd_intf_net [get_bd_intf_ports iic_dac_0] [get_bd_intf_pins axi_iic_dac_0/IIC]
connect_bd_intf_net [get_bd_intf_ports iic_dac_1] [get_bd_intf_pins axi_iic_dac_1/IIC]
connect_bd_intf_net [get_bd_intf_ports iic_dac_2] [get_bd_intf_pins axi_iic_dac_2/IIC]
connect_bd_intf_net [get_bd_intf_ports iic_dps_0] [get_bd_intf_pins axi_iic_dps_0/IIC]
connect_bd_intf_net [get_bd_intf_ports iic_dps_1] [get_bd_intf_pins axi_iic_dps_1/IIC]
connect_bd_intf_net [get_bd_intf_ports iic_dps_2] [get_bd_intf_pins axi_iic_dps_2/IIC]
connect_bd_intf_net [get_bd_intf_ports iic_dps_3] [get_bd_intf_pins axi_iic_dps_3/IIC]
connect_bd_intf_net [get_bd_intf_ports iic_dps_4] [get_bd_intf_pins axi_iic_dps_4/IIC]
connect_bd_intf_net [get_bd_intf_ports iic_dps_5] [get_bd_intf_pins axi_iic_dps_5/IIC]
connect_bd_intf_net [get_bd_intf_ports iic_dps_6] [get_bd_intf_pins axi_iic_dps_6/IIC]
connect_bd_intf_net [get_bd_intf_ports iic_dps_7] [get_bd_intf_pins axi_iic_dps_7/IIC]
connect_bd_intf_net [get_bd_intf_ports iic_eep] [get_bd_intf_pins axi_iic_eep/IIC]
connect_bd_intf_net [get_bd_intf_ports iic_hv_ina_0] [get_bd_intf_pins axi_iic_hv_ina_0/IIC]
connect_bd_intf_net [get_bd_intf_ports iic_hv_ina_1] [get_bd_intf_pins axi_iic_hv_ina_1/IIC]
connect_bd_intf_net [get_bd_intf_ports iic_hv_ina_2] [get_bd_intf_pins axi_iic_hv_ina_2/IIC]
connect_bd_intf_net [get_bd_intf_ports iic_hv_ina_3] [get_bd_intf_pins axi_iic_hv_ina_3/IIC]
connect_bd_intf_net [get_bd_intf_ports iic_ina_0] [get_bd_intf_pins axi_iic_ina_0/IIC]
connect_bd_intf_net [get_bd_intf_ports iic_ina_10] [get_bd_intf_pins axi_iic_ina_10/IIC]
connect_bd_intf_net [get_bd_intf_ports iic_ina_11] [get_bd_intf_pins axi_iic_ina_11/IIC]
connect_bd_intf_net [get_bd_intf_ports iic_ina_12] [get_bd_intf_pins axi_iic_ina_12/IIC]
connect_bd_intf_net [get_bd_intf_ports iic_ina_13] [get_bd_intf_pins axi_iic_ina_13/IIC]
connect_bd_intf_net [get_bd_intf_ports iic_ina_14] [get_bd_intf_pins axi_iic_ina_14/IIC]
connect_bd_intf_net [get_bd_intf_ports iic_ina_15] [get_bd_intf_pins axi_iic_ina_15/IIC]
connect_bd_intf_net [get_bd_intf_ports iic_ina_1] [get_bd_intf_pins axi_iic_ina_1/IIC]
connect_bd_intf_net [get_bd_intf_ports iic_ina_2] [get_bd_intf_pins axi_iic_ina_2/IIC]
connect_bd_intf_net [get_bd_intf_ports iic_ina_3] [get_bd_intf_pins axi_iic_ina_3/IIC]
connect_bd_intf_net [get_bd_intf_ports iic_ina_4] [get_bd_intf_pins axi_iic_ina_4/IIC]
connect_bd_intf_net [get_bd_intf_ports iic_ina_5] [get_bd_intf_pins axi_iic_ina_5/IIC]
connect_bd_intf_net [get_bd_intf_ports iic_ina_6] [get_bd_intf_pins axi_iic_ina_6/IIC]
connect_bd_intf_net [get_bd_intf_ports iic_ina_7] [get_bd_intf_pins axi_iic_ina_7/IIC]
connect_bd_intf_net [get_bd_intf_ports iic_ina_8] [get_bd_intf_pins axi_iic_ina_8/IIC]
connect_bd_intf_net [get_bd_intf_ports iic_ina_9] [get_bd_intf_pins axi_iic_ina_9/IIC]
connect_bd_intf_net [get_bd_intf_pins axi_interconnect_i2c_1/M00_AXI] [get_bd_intf_pins axi_iic_ina_0/S_AXI]
connect_bd_intf_net [get_bd_intf_pins axi_interconnect_i2c_1/M01_AXI] [get_bd_intf_pins axi_iic_ina_1/S_AXI]
connect_bd_intf_net [get_bd_intf_pins axi_interconnect_i2c_1/M02_AXI] [get_bd_intf_pins axi_iic_ina_2/S_AXI]
connect_bd_intf_net [get_bd_intf_pins axi_interconnect_i2c_1/M03_AXI] [get_bd_intf_pins axi_iic_ina_3/S_AXI]
connect_bd_intf_net [get_bd_intf_pins axi_interconnect_i2c_1/M04_AXI] [get_bd_intf_pins axi_iic_ina_4/S_AXI]
connect_bd_intf_net [get_bd_intf_pins axi_interconnect_i2c_1/M05_AXI] [get_bd_intf_pins axi_iic_ina_5/S_AXI]
connect_bd_intf_net [get_bd_intf_pins axi_interconnect_i2c_1/M06_AXI] [get_bd_intf_pins axi_iic_ina_6/S_AXI]
connect_bd_intf_net [get_bd_intf_pins axi_interconnect_i2c_1/M07_AXI] [get_bd_intf_pins axi_iic_ina_7/S_AXI]
connect_bd_intf_net [get_bd_intf_pins axi_interconnect_i2c_1/M08_AXI] [get_bd_intf_pins axi_iic_ina_8/S_AXI]
connect_bd_intf_net [get_bd_intf_pins axi_interconnect_i2c_1/M09_AXI] [get_bd_intf_pins axi_iic_ina_9/S_AXI]
connect_bd_intf_net [get_bd_intf_pins axi_interconnect_i2c_1/M10_AXI] [get_bd_intf_pins axi_iic_ina_10/S_AXI]
connect_bd_intf_net [get_bd_intf_pins axi_interconnect_i2c_1/M11_AXI] [get_bd_intf_pins axi_iic_ina_11/S_AXI]
connect_bd_intf_net [get_bd_intf_pins axi_interconnect_i2c_1/M12_AXI] [get_bd_intf_pins axi_iic_ina_12/S_AXI]
connect_bd_intf_net [get_bd_intf_pins axi_interconnect_i2c_1/M13_AXI] [get_bd_intf_pins axi_iic_ina_13/S_AXI]
connect_bd_intf_net [get_bd_intf_pins axi_interconnect_i2c_1/M14_AXI] [get_bd_intf_pins axi_iic_ina_14/S_AXI]
connect_bd_intf_net [get_bd_intf_pins axi_interconnect_i2c_1/M15_AXI] [get_bd_intf_pins axi_iic_ina_15/S_AXI]
connect_bd_intf_net -intf_net axi_interconnect_i2c_M00_AXI [get_bd_intf_pins axi_iic_eep/S_AXI] [get_bd_intf_pins axi_interconnect_i2c_0/M00_AXI]
connect_bd_intf_net -intf_net axi_interconnect_i2c_M01_AXI [get_bd_intf_pins axi_interconnect_i2c_0/M01_AXI] [get_bd_intf_pins axi_iic_dac_0/S_AXI]
connect_bd_intf_net -intf_net axi_interconnect_i2c_M02_AXI [get_bd_intf_pins axi_interconnect_i2c_0/M02_AXI] [get_bd_intf_pins axi_iic_dac_1/S_AXI]
connect_bd_intf_net -intf_net axi_interconnect_i2c_M03_AXI [get_bd_intf_pins axi_interconnect_i2c_0/M03_AXI] [get_bd_intf_pins axi_iic_dac_2/S_AXI]
connect_bd_intf_net -intf_net axi_interconnect_i2c_M04_AXI [get_bd_intf_pins axi_iic_dps_0/S_AXI] [get_bd_intf_pins axi_interconnect_i2c_0/M04_AXI]
connect_bd_intf_net -intf_net axi_interconnect_i2c_M05_AXI [get_bd_intf_pins axi_iic_dps_1/S_AXI] [get_bd_intf_pins axi_interconnect_i2c_0/M05_AXI]
connect_bd_intf_net -intf_net axi_interconnect_i2c_M06_AXI [get_bd_intf_pins axi_interconnect_i2c_0/M06_AXI] [get_bd_intf_pins axi_iic_dps_2/S_AXI]
connect_bd_intf_net -intf_net axi_interconnect_i2c_M07_AXI [get_bd_intf_pins axi_interconnect_i2c_0/M07_AXI] [get_bd_intf_pins axi_iic_dps_3/S_AXI]
connect_bd_intf_net -intf_net axi_interconnect_i2c_M08_AXI [get_bd_intf_pins axi_interconnect_i2c_0/M08_AXI] [get_bd_intf_pins axi_iic_dps_4/S_AXI]
connect_bd_intf_net -intf_net axi_interconnect_i2c_M09_AXI [get_bd_intf_pins axi_interconnect_i2c_0/M09_AXI] [get_bd_intf_pins axi_iic_dps_5/S_AXI]
connect_bd_intf_net -intf_net axi_interconnect_i2c_M10_AXI [get_bd_intf_pins axi_interconnect_i2c_0/M10_AXI] [get_bd_intf_pins axi_iic_dps_6/S_AXI]
connect_bd_intf_net -intf_net axi_interconnect_i2c_M11_AXI [get_bd_intf_pins axi_interconnect_i2c_0/M11_AXI] [get_bd_intf_pins axi_iic_dps_7/S_AXI]
connect_bd_intf_net -intf_net axi_interconnect_i2c_M12_AXI [get_bd_intf_pins axi_interconnect_i2c_0/M12_AXI] [get_bd_intf_pins axi_iic_hv_ina_0/S_AXI]
connect_bd_intf_net -intf_net axi_interconnect_i2c_M13_AXI [get_bd_intf_pins axi_interconnect_i2c_0/M13_AXI] [get_bd_intf_pins axi_iic_hv_ina_1/S_AXI]
connect_bd_intf_net -intf_net axi_interconnect_i2c_M14_AXI [get_bd_intf_pins axi_interconnect_i2c_0/M14_AXI] [get_bd_intf_pins axi_iic_hv_ina_3/S_AXI]
connect_bd_intf_net -intf_net axi_interconnect_i2c_M15_AXI [get_bd_intf_pins axi_interconnect_i2c_0/M15_AXI] [get_bd_intf_pins axi_iic_hv_ina_2/S_AXI]
connect_bd_intf_net [get_bd_intf_pins axi_interconnect_xdma_bypass/M00_AXI] [get_bd_intf_pins axi_bram_ctrl_all_sts/S_AXI]
connect_bd_intf_net [get_bd_intf_pins axi_interconnect_xdma_bypass/M01_AXI] [get_bd_intf_pins board_info_0/S00_AXI]
connect_bd_intf_net [get_bd_intf_pins axi_interconnect_xdma_bypass/M02_AXI] [get_bd_intf_pins cfgx8_c2x_buf/S_AXI]
connect_bd_intf_net [get_bd_intf_pins axi_interconnect_xdma_bypass/M03_AXI] [get_bd_intf_pins lbx8_c2p_buf/S_AXI]
connect_bd_intf_net [get_bd_intf_pins axi_interconnect_xdma_bypass/M04_AXI] [get_bd_intf_pins cfgx8_c2x_0/S00_AXI]
connect_bd_intf_net [get_bd_intf_pins axi_interconnect_xdma_bypass/M05_AXI] [get_bd_intf_pins lbx8_c2p_0/S00_AXI]
connect_bd_intf_net [get_bd_intf_pins axi_interconnect_xdma_bypass/M06_AXI] [get_bd_intf_pins adc_ad4855_0/S00_AXI]
connect_bd_intf_net [get_bd_intf_pins axi_interconnect_xdma_bypass/M07_AXI] [get_bd_intf_pins dac_ad5677_0/S00_AXI]
connect_bd_intf_net [get_bd_intf_pins axi_interconnect_xdma_bypass/M08_AXI] [get_bd_intf_pins dps_i2c_0/S00_AXI]
connect_bd_intf_net [get_bd_intf_pins axi_interconnect_xdma_bypass/M09_AXI] [get_bd_intf_pins ina_i2c_0/S00_AXI]
connect_bd_intf_net [get_bd_intf_pins axi_interconnect_xdma_bypass/M10_AXI] [get_bd_intf_pins eep_i2c_0/S00_AXI]
connect_bd_intf_net [get_bd_intf_pins axi_interconnect_xdma_bypass/M11_AXI] [get_bd_intf_pins cfg_prom_0/S00_AXI]
connect_bd_intf_net [get_bd_intf_pins axi_interconnect_xdma_master/M00_AXI] [get_bd_intf_pins axi_bram_ctrl_0/S_AXI]
connect_bd_intf_net -intf_net axi_quad_spi_0_SPI_0 [get_bd_intf_ports spi_prom] [get_bd_intf_pins axi_quad_spi_prom/SPI_0]
connect_bd_intf_net [get_bd_intf_ports uart_dbg] [get_bd_intf_pins axi_uartlite_0/UART]
connect_bd_intf_net [get_bd_intf_pins cfgx8_c2x_0/cfg_buf] [get_bd_intf_pins cfgx8_c2x_buf_bram/BRAM_PORTA]
connect_bd_intf_net [get_bd_intf_pins cfgx8_c2x_buf/BRAM_PORTA] [get_bd_intf_pins cfgx8_c2x_buf_bram/BRAM_PORTB]
connect_bd_intf_net [get_bd_intf_pins lbx8_c2p_0/lb_pg_buf] [get_bd_intf_pins lbx8_c2p_buf_bram/BRAM_PORTA]
connect_bd_intf_net [get_bd_intf_pins lbx8_c2p_buf/BRAM_PORTA] [get_bd_intf_pins lbx8_c2p_buf_bram/BRAM_PORTB]
connect_bd_intf_net -intf_net microblaze_0_axi_dp [get_bd_intf_pins microblaze_0_axi_periph/S00_AXI] [get_bd_intf_pins microblaze_0/M_AXI_DP]
connect_bd_intf_net [get_bd_intf_pins microblaze_0_axi_periph/M01_AXI] [get_bd_intf_pins axi_timer_0/S_AXI]
connect_bd_intf_net [get_bd_intf_pins microblaze_0_axi_periph/M02_AXI] [get_bd_intf_pins axi_uartlite_0/S_AXI]
connect_bd_intf_net [get_bd_intf_pins microblaze_0_axi_periph/M03_AXI] [get_bd_intf_pins axi_hwicap_0/S_AXI_LITE]
connect_bd_intf_net [get_bd_intf_pins microblaze_0_axi_periph/M04_AXI] [get_bd_intf_pins axi_quad_spi_prom/AXI_LITE]
connect_bd_intf_net [get_bd_intf_pins microblaze_0_axi_periph/M05_AXI] [get_bd_intf_pins axi_interconnect_i2c_0/S00_AXI]
connect_bd_intf_net [get_bd_intf_pins microblaze_0_axi_periph/M06_AXI] [get_bd_intf_pins axi_interconnect_i2c_1/S00_AXI]
connect_bd_intf_net [get_bd_intf_pins microblaze_0_axi_periph/M07_AXI] [get_bd_intf_pins axi_interconnect_xdma_bypass/S00_AXI]
connect_bd_intf_net [get_bd_intf_pins mdm_1/MBDEBUG_0] [get_bd_intf_pins microblaze_0/DEBUG]
connect_bd_intf_net [get_bd_intf_pins microblaze_0/DLMB] [get_bd_intf_pins microblaze_0_local_memory/DLMB]
connect_bd_intf_net [get_bd_intf_pins microblaze_0/ILMB] [get_bd_intf_pins microblaze_0_local_memory/ILMB]
connect_bd_intf_net -intf_net microblaze_0_intc_axi [get_bd_intf_pins microblaze_0_axi_periph/M00_AXI] [get_bd_intf_pins microblaze_0_axi_intc/s_axi]
connect_bd_intf_net [get_bd_intf_pins microblaze_0_axi_intc/interrupt] [get_bd_intf_pins microblaze_0/INTERRUPT]
connect_bd_intf_net [get_bd_intf_pins xdma_0/M_AXI] [get_bd_intf_pins axi_interconnect_xdma_master/S00_AXI]
connect_bd_intf_net [get_bd_intf_pins xdma_0/M_AXI_BYPASS] [get_bd_intf_pins axi_interconnect_xdma_bypass/S01_AXI]
connect_bd_intf_net [get_bd_intf_ports pcie_mgt] [get_bd_intf_pins xdma_0/pcie_mgt]
connect_bd_net [get_bd_ports bib_id_0] [get_bd_pins board_info_0/bib_id]
connect_bd_net [get_bd_ports pg_lb_ad_0] [get_bd_pins lbx8_c2p_0/pg_lb_ad]
connect_bd_net [get_bd_ports adc_csdio_0] [get_bd_pins adc_ad4855_0/adc_csdio]
connect_bd_net [get_bd_pins adc_ad4855_0/adc_cnv] [get_bd_ports adc_cnv_0]
connect_bd_net [get_bd_pins adc_ad4855_0/adc_csck] [get_bd_ports adc_csck_0]
connect_bd_net [get_bd_pins adc_ad4855_0/adc_csn] [get_bd_ports adc_csn_0]
connect_bd_net [get_bd_pins adc_ad4855_0/adc_pd] [get_bd_ports adc_pd_0]
connect_bd_net [get_bd_pins adc_ad4855_0/adc_scki] [get_bd_ports adc_scki_0]
connect_bd_net [get_bd_pins adc_ad4855_0/mux_a] [get_bd_ports mux_a_0]
connect_bd_net -net adc_busy_0_1 [get_bd_ports adc_busy_0] [get_bd_pins adc_ad4855_0/adc_busy]
connect_bd_net -net adc_csdo_0_1 [get_bd_ports adc_csdo_0] [get_bd_pins adc_ad4855_0/adc_csdo]
connect_bd_net -net adc_scko_0_1 [get_bd_ports adc_scko_0] [get_bd_pins adc_ad4855_0/adc_scko]
connect_bd_net -net adc_sdo0_0_1 [get_bd_ports adc_sdo0_0] [get_bd_pins adc_ad4855_0/adc_sdo0]
connect_bd_net -net adc_sdo1_0_1 [get_bd_ports adc_sdo1_0] [get_bd_pins adc_ad4855_0/adc_sdo1]
connect_bd_net -net adc_sdo2_0_1 [get_bd_ports adc_sdo2_0] [get_bd_pins adc_ad4855_0/adc_sdo2]
connect_bd_net -net adc_sdo3_0_1 [get_bd_ports adc_sdo3_0] [get_bd_pins adc_ad4855_0/adc_sdo3]
connect_bd_net -net adc_sdo4_0_1 [get_bd_ports adc_sdo4_0] [get_bd_pins adc_ad4855_0/adc_sdo4]
connect_bd_net -net adc_sdo5_0_1 [get_bd_ports adc_sdo5_0] [get_bd_pins adc_ad4855_0/adc_sdo5]
connect_bd_net -net adc_sdo6_0_1 [get_bd_ports adc_sdo6_0] [get_bd_pins adc_ad4855_0/adc_sdo6]
connect_bd_net -net adc_sdo7_0_1 [get_bd_ports adc_sdo7_0] [get_bd_pins adc_ad4855_0/adc_sdo7]
connect_bd_net [get_bd_pins axi_quad_spi_prom/ip2intc_irpt] [get_bd_pins microblaze_0_xlconcat/In1]
connect_bd_net [get_bd_pins axi_uartlite_0/interrupt] [get_bd_pins microblaze_0_xlconcat/In0]
connect_bd_net -net bib_chkn_0_1 [get_bd_ports bib_chkn_0] [get_bd_pins board_info_0/bib_chkn]
connect_bd_net [get_bd_pins board_info_0/bib_sense_sel] [get_bd_ports bib_sense_sel_0]
connect_bd_net [get_bd_pins board_info_0/ctrl_rly_dgs] [get_bd_ports ctrl_rly_dgs_0]
connect_bd_net [get_bd_pins board_info_0/led_act] [get_bd_ports led_act_0]
connect_bd_net [get_bd_pins board_info_0/led_err] [get_bd_ports led_err_0]
connect_bd_net [get_bd_pins board_info_0/led_o] [get_bd_ports led_o_0]
connect_bd_net [get_bd_pins board_info_0/led_on] [get_bd_ports led_on_0]
connect_bd_net [get_bd_pins cfgx8_c2x_0/pg_cfg_cclk] [get_bd_ports pg_cfg_cclk_0]
connect_bd_net [get_bd_pins cfgx8_c2x_0/pg_cfg_csi_b] [get_bd_ports pg_cfg_csi_b_0]
connect_bd_net [get_bd_pins cfgx8_c2x_0/pg_cfg_data] [get_bd_ports pg_cfg_data_0]
connect_bd_net [get_bd_pins cfgx8_c2x_0/pg_cfg_pgm_b] [get_bd_ports pg_cfg_pgm_b_0]
connect_bd_net [get_bd_pins cfgx8_c2x_0/pg_cfg_rdwr_b] [get_bd_ports pg_cfg_rdwr_b_0]
connect_bd_net [get_bd_pins clk_wiz_1/clk_out2] [get_bd_pins lbx8_c2p_0/clk200]
connect_bd_net [get_bd_pins clk_wiz_1/locked] [get_bd_pins rst_clk_wiz_1_100M/dcm_locked]
connect_bd_net [get_bd_pins constant_high/dout] \
  [get_bd_pins cfgx8_c2x_0/tg_cfg_init_b] [get_bd_pins cfgx8_c2x_0/tg_cfg_done] [get_bd_pins rst_clk_wiz_1_100M/ext_reset_in]
connect_bd_net [get_bd_pins constant_low/dout] \
  [get_bd_pins axi_timer_0/capturetrig0] [get_bd_pins axi_timer_0/capturetrig1] [get_bd_pins axi_timer_0/freeze] \
  [get_bd_pins xdma_0/usr_irq_req]
connect_bd_net [get_bd_pins dac_ad5677_0/dac_ldacn] [get_bd_ports dac_ldacn_0]
connect_bd_net [get_bd_pins dac_ad5677_0/dac_rstn] [get_bd_ports dac_rstn_0]
connect_bd_net [get_bd_pins dps_i2c_0/dps_cal_en] [get_bd_ports dps_cal_en_0]
connect_bd_net [get_bd_pins dps_i2c_0/dps_run] [get_bd_ports dps_run_0]
connect_bd_net [get_bd_pins dps_i2c_0/hv_dps_cal_en] [get_bd_ports hv_dps_cal_en_0]
connect_bd_net [get_bd_pins dps_i2c_0/hv_dps_en] [get_bd_ports hv_dps_en_0]
connect_bd_net [get_bd_pins dps_i2c_0/vref_en] [get_bd_ports vref_en_0]
connect_bd_net -net dps_nalert_0_1 [get_bd_ports dps_nalert_0] [get_bd_pins dps_i2c_0/dps_nalert]
connect_bd_net -net dps_nfault_0_1 [get_bd_ports dps_nfault_0] [get_bd_pins dps_i2c_0/dps_nfault]
connect_bd_net [get_bd_pins lbx8_c2p_0/pg_lb_clk] [get_bd_ports pg_lb_clk_0]
connect_bd_net [get_bd_pins lbx8_c2p_0/pg_lb_rstn] [get_bd_ports pg_lb_rstn_0]
connect_bd_net [get_bd_pins lbx8_c2p_0/pg_lb_wr] [get_bd_ports pg_lb_wr_0]
connect_bd_net [get_bd_pins mdm_1/Debug_SYS_Rst] [get_bd_pins rst_clk_wiz_1_100M/mb_debug_sys_rst]
connect_bd_net -net microblaze_0_Clk [get_bd_pins clk_wiz_1/clk_out1] \
  [get_bd_pins microblaze_0_local_memory/LMB_Clk] [get_bd_pins cfgx8_c2x_0/s00_axi_aclk] \
  [get_bd_pins lbx8_c2p_0/s00_axi_aclk] [get_bd_pins cfg_prom_0/s00_axi_aclk] [get_bd_pins dac_ad5677_0/s00_axi_aclk] \
  [get_bd_pins dps_i2c_0/s00_axi_aclk] [get_bd_pins eep_i2c_0/s00_axi_aclk] [get_bd_pins ina_i2c_0/s00_axi_aclk] \
  [get_bd_pins adc_ad4855_0/s00_axi_aclk] [get_bd_pins cfgx8_c2x_buf/s_axi_aclk] [get_bd_pins axi_hwicap_0/icap_clk] \
  [get_bd_pins axi_hwicap_0/s_axi_aclk] [get_bd_pins axi_iic_dac_0/s_axi_aclk] [get_bd_pins axi_iic_dac_1/s_axi_aclk] \
  [get_bd_pins axi_iic_dac_2/s_axi_aclk] [get_bd_pins axi_iic_dps_0/s_axi_aclk] [get_bd_pins axi_iic_eep/s_axi_aclk] \
  [get_bd_pins axi_iic_dps_1/s_axi_aclk] [get_bd_pins axi_iic_dps_2/s_axi_aclk] [get_bd_pins axi_iic_dps_3/s_axi_aclk] \
  [get_bd_pins axi_iic_dps_4/s_axi_aclk] [get_bd_pins axi_iic_dps_5/s_axi_aclk] [get_bd_pins axi_iic_dps_6/s_axi_aclk] \
  [get_bd_pins axi_iic_dps_7/s_axi_aclk] [get_bd_pins axi_iic_hv_ina_0/s_axi_aclk] [get_bd_pins axi_iic_hv_ina_1/s_axi_aclk] \
  [get_bd_pins axi_iic_hv_ina_2/s_axi_aclk] [get_bd_pins axi_iic_hv_ina_3/s_axi_aclk] [get_bd_pins axi_iic_ina_0/s_axi_aclk] \
  [get_bd_pins axi_iic_ina_1/s_axi_aclk] [get_bd_pins axi_iic_ina_2/s_axi_aclk] [get_bd_pins axi_iic_ina_3/s_axi_aclk] \
  [get_bd_pins axi_iic_ina_12/s_axi_aclk] [get_bd_pins axi_iic_ina_13/s_axi_aclk] [get_bd_pins axi_iic_ina_14/s_axi_aclk] \
  [get_bd_pins axi_iic_ina_15/s_axi_aclk] [get_bd_pins axi_iic_ina_4/s_axi_aclk] [get_bd_pins axi_iic_ina_5/s_axi_aclk] \
  [get_bd_pins axi_iic_ina_6/s_axi_aclk] [get_bd_pins axi_iic_ina_7/s_axi_aclk] [get_bd_pins axi_iic_ina_8/s_axi_aclk] \
  [get_bd_pins axi_iic_ina_9/s_axi_aclk] [get_bd_pins axi_iic_ina_10/s_axi_aclk] [get_bd_pins axi_iic_ina_11/s_axi_aclk] \
  [get_bd_pins axi_interconnect_i2c_0/ACLK] [get_bd_pins axi_interconnect_i2c_0/S00_ACLK] \
  [get_bd_pins axi_interconnect_i2c_0/M00_ACLK] [get_bd_pins axi_interconnect_i2c_0/M01_ACLK] \
  [get_bd_pins axi_interconnect_i2c_0/M02_ACLK] [get_bd_pins axi_interconnect_i2c_0/M03_ACLK] \
  [get_bd_pins axi_interconnect_i2c_0/M04_ACLK] [get_bd_pins axi_interconnect_i2c_0/M05_ACLK] \
  [get_bd_pins axi_interconnect_i2c_0/M06_ACLK] [get_bd_pins axi_interconnect_i2c_0/M07_ACLK] \
  [get_bd_pins axi_interconnect_i2c_0/M08_ACLK] [get_bd_pins axi_interconnect_i2c_0/M09_ACLK] \
  [get_bd_pins axi_interconnect_i2c_0/M10_ACLK] [get_bd_pins axi_interconnect_i2c_0/M11_ACLK] \
  [get_bd_pins axi_interconnect_i2c_0/M12_ACLK] [get_bd_pins axi_interconnect_i2c_0/M13_ACLK] \
  [get_bd_pins axi_interconnect_i2c_0/M14_ACLK] [get_bd_pins axi_interconnect_i2c_0/M15_ACLK] \
  [get_bd_pins axi_interconnect_i2c_1/ACLK] [get_bd_pins axi_interconnect_i2c_1/S00_ACLK] \
  [get_bd_pins axi_interconnect_i2c_1/M00_ACLK] [get_bd_pins axi_interconnect_i2c_1/M01_ACLK] \
  [get_bd_pins axi_interconnect_i2c_1/M02_ACLK] [get_bd_pins axi_interconnect_i2c_1/M03_ACLK] \
  [get_bd_pins axi_interconnect_i2c_1/M04_ACLK] [get_bd_pins axi_interconnect_i2c_1/M05_ACLK] \
  [get_bd_pins axi_interconnect_i2c_1/M06_ACLK] [get_bd_pins axi_interconnect_i2c_1/M07_ACLK] \
  [get_bd_pins axi_interconnect_i2c_1/M08_ACLK] [get_bd_pins axi_interconnect_i2c_1/M09_ACLK] \
  [get_bd_pins axi_interconnect_i2c_1/M10_ACLK] [get_bd_pins axi_interconnect_i2c_1/M11_ACLK] \
  [get_bd_pins axi_interconnect_i2c_1/M12_ACLK] [get_bd_pins axi_interconnect_i2c_1/M13_ACLK] \
  [get_bd_pins axi_interconnect_i2c_1/M14_ACLK] [get_bd_pins axi_interconnect_i2c_1/M15_ACLK] \
  [get_bd_pins axi_interconnect_xdma_bypass/ACLK] [get_bd_pins axi_interconnect_xdma_bypass/S00_ACLK] \
  [get_bd_pins axi_interconnect_xdma_bypass/M00_ACLK] [get_bd_pins axi_interconnect_xdma_bypass/M01_ACLK] \
  [get_bd_pins axi_interconnect_xdma_bypass/M02_ACLK] [get_bd_pins axi_interconnect_xdma_bypass/M03_ACLK] \
  [get_bd_pins axi_interconnect_xdma_bypass/M04_ACLK] [get_bd_pins axi_interconnect_xdma_bypass/M05_ACLK] \
  [get_bd_pins axi_interconnect_xdma_bypass/M06_ACLK] [get_bd_pins axi_interconnect_xdma_bypass/M07_ACLK] \
  [get_bd_pins axi_interconnect_xdma_bypass/M08_ACLK] [get_bd_pins axi_interconnect_xdma_bypass/M09_ACLK] \
  [get_bd_pins axi_interconnect_xdma_bypass/M10_ACLK] [get_bd_pins axi_interconnect_xdma_bypass/M11_ACLK] \
  [get_bd_pins axi_quad_spi_prom/ext_spi_clk] [get_bd_pins axi_quad_spi_prom/s_axi_aclk] [get_bd_pins axi_timer_0/s_axi_aclk] \
  [get_bd_pins axi_uartlite_0/s_axi_aclk] [get_bd_pins lbx8_c2p_buf/s_axi_aclk] [get_bd_pins microblaze_0/Clk] \
  [get_bd_pins microblaze_0_axi_intc/s_axi_aclk] [get_bd_pins microblaze_0_axi_intc/processor_clk] \
  [get_bd_pins microblaze_0_axi_periph/ACLK] [get_bd_pins microblaze_0_axi_periph/S00_ACLK] \
  [get_bd_pins microblaze_0_axi_periph/M00_ACLK] [get_bd_pins microblaze_0_axi_periph/M01_ACLK] \
  [get_bd_pins microblaze_0_axi_periph/M02_ACLK] [get_bd_pins microblaze_0_axi_periph/M03_ACLK] \
  [get_bd_pins microblaze_0_axi_periph/M04_ACLK] [get_bd_pins microblaze_0_axi_periph/M05_ACLK] \
  [get_bd_pins microblaze_0_axi_periph/M06_ACLK] [get_bd_pins microblaze_0_axi_periph/M07_ACLK] \
  [get_bd_pins rst_clk_wiz_1_100M/slowest_sync_clk] [get_bd_pins axi_bram_ctrl_all_sts/s_axi_aclk] \
  [get_bd_pins board_info_0/s00_axi_aclk]
connect_bd_net -net microblaze_0_intr [get_bd_pins microblaze_0_xlconcat/dout] [get_bd_pins microblaze_0_axi_intc/intr]
connect_bd_net -net pg_cfg_done_0_1 [get_bd_ports pg_cfg_done_0] [get_bd_pins cfgx8_c2x_0/pg_cfg_done]
connect_bd_net -net pg_cfg_init_b_0_1 [get_bd_ports pg_cfg_init_b_0] [get_bd_pins cfgx8_c2x_0/pg_cfg_init_b]
connect_bd_net -net pg_lb_error_0_1 [get_bd_ports pg_lb_error_0] [get_bd_pins lbx8_c2p_0/pg_lb_error]
connect_bd_net -net pg_lb_last_0_1 [get_bd_ports pg_lb_last_0] [get_bd_pins lbx8_c2p_0/pg_lb_last]
connect_bd_net -net pg_lb_valid_0_1 [get_bd_ports pg_lb_valid_0] [get_bd_pins lbx8_c2p_0/pg_lb_valid]
connect_bd_net -net pg_rev_0_1 [get_bd_ports pg_rev_0] [get_bd_pins board_info_0/pg_rev]
connect_bd_net [get_bd_pins rst_clk_wiz_1_100M/bus_struct_reset] [get_bd_pins microblaze_0_local_memory/SYS_Rst]
connect_bd_net [get_bd_pins rst_clk_wiz_1_100M/mb_reset] [get_bd_pins microblaze_0/Reset] [get_bd_pins microblaze_0_axi_intc/processor_rst]
connect_bd_net [get_bd_pins rst_clk_wiz_1_100M/peripheral_aresetn] \
  [get_bd_pins cfgx8_c2x_0/s00_axi_aresetn] [get_bd_pins lbx8_c2p_0/s00_axi_aresetn] [get_bd_pins cfg_prom_0/s00_axi_aresetn] \
  [get_bd_pins dac_ad5677_0/s00_axi_aresetn] [get_bd_pins dps_i2c_0/s00_axi_aresetn] [get_bd_pins eep_i2c_0/s00_axi_aresetn] \
  [get_bd_pins ina_i2c_0/s00_axi_aresetn] [get_bd_pins adc_ad4855_0/s00_axi_aresetn] \
  [get_bd_pins cfgx8_c2x_buf/s_axi_aresetn] [get_bd_pins axi_hwicap_0/s_axi_aresetn] \
  [get_bd_pins axi_iic_dac_0/s_axi_aresetn] [get_bd_pins axi_iic_dac_1/s_axi_aresetn] \
  [get_bd_pins axi_iic_dac_2/s_axi_aresetn] [get_bd_pins axi_iic_dps_0/s_axi_aresetn] [get_bd_pins axi_iic_eep/s_axi_aresetn] \
  [get_bd_pins axi_iic_dps_1/s_axi_aresetn] [get_bd_pins axi_iic_dps_2/s_axi_aresetn] \
  [get_bd_pins axi_iic_dps_3/s_axi_aresetn] [get_bd_pins axi_iic_dps_4/s_axi_aresetn] \
  [get_bd_pins axi_iic_dps_5/s_axi_aresetn] [get_bd_pins axi_iic_dps_6/s_axi_aresetn] \
  [get_bd_pins axi_iic_dps_7/s_axi_aresetn] [get_bd_pins axi_iic_hv_ina_0/s_axi_aresetn] \
  [get_bd_pins axi_iic_hv_ina_1/s_axi_aresetn] [get_bd_pins axi_iic_hv_ina_2/s_axi_aresetn] \
  [get_bd_pins axi_iic_hv_ina_3/s_axi_aresetn] [get_bd_pins axi_iic_ina_0/s_axi_aresetn] \
  [get_bd_pins axi_iic_ina_1/s_axi_aresetn] [get_bd_pins axi_iic_ina_2/s_axi_aresetn] \
  [get_bd_pins axi_iic_ina_3/s_axi_aresetn] [get_bd_pins axi_iic_ina_12/s_axi_aresetn] \
  [get_bd_pins axi_iic_ina_13/s_axi_aresetn] [get_bd_pins axi_iic_ina_14/s_axi_aresetn] \
  [get_bd_pins axi_iic_ina_15/s_axi_aresetn] [get_bd_pins axi_iic_ina_4/s_axi_aresetn] \
  [get_bd_pins axi_iic_ina_5/s_axi_aresetn] [get_bd_pins axi_iic_ina_6/s_axi_aresetn] \
  [get_bd_pins axi_iic_ina_7/s_axi_aresetn] [get_bd_pins axi_iic_ina_8/s_axi_aresetn] \
  [get_bd_pins axi_iic_ina_9/s_axi_aresetn] [get_bd_pins axi_iic_ina_10/s_axi_aresetn] \
  [get_bd_pins axi_iic_ina_11/s_axi_aresetn] [get_bd_pins axi_interconnect_i2c_0/ARESETN] \
  [get_bd_pins axi_interconnect_i2c_0/S00_ARESETN] [get_bd_pins axi_interconnect_i2c_0/M00_ARESETN] \
  [get_bd_pins axi_interconnect_i2c_0/M01_ARESETN] [get_bd_pins axi_interconnect_i2c_0/M02_ARESETN] \
  [get_bd_pins axi_interconnect_i2c_0/M03_ARESETN] [get_bd_pins axi_interconnect_i2c_0/M04_ARESETN] \
  [get_bd_pins axi_interconnect_i2c_0/M05_ARESETN] [get_bd_pins axi_interconnect_i2c_0/M06_ARESETN] \
  [get_bd_pins axi_interconnect_i2c_0/M07_ARESETN] [get_bd_pins axi_interconnect_i2c_0/M08_ARESETN] \
  [get_bd_pins axi_interconnect_i2c_0/M09_ARESETN] [get_bd_pins axi_interconnect_i2c_0/M10_ARESETN] \
  [get_bd_pins axi_interconnect_i2c_0/M11_ARESETN] [get_bd_pins axi_interconnect_i2c_0/M12_ARESETN] \
  [get_bd_pins axi_interconnect_i2c_0/M13_ARESETN] [get_bd_pins axi_interconnect_i2c_0/M14_ARESETN] \
  [get_bd_pins axi_interconnect_i2c_0/M15_ARESETN] [get_bd_pins axi_interconnect_i2c_1/ARESETN] \
  [get_bd_pins axi_interconnect_i2c_1/S00_ARESETN] [get_bd_pins axi_interconnect_i2c_1/M00_ARESETN] \
  [get_bd_pins axi_interconnect_i2c_1/M01_ARESETN] [get_bd_pins axi_interconnect_i2c_1/M02_ARESETN] \
  [get_bd_pins axi_interconnect_i2c_1/M03_ARESETN] [get_bd_pins axi_interconnect_i2c_1/M04_ARESETN] \
  [get_bd_pins axi_interconnect_i2c_1/M05_ARESETN] [get_bd_pins axi_interconnect_i2c_1/M06_ARESETN] \
  [get_bd_pins axi_interconnect_i2c_1/M07_ARESETN] [get_bd_pins axi_interconnect_i2c_1/M08_ARESETN] \
  [get_bd_pins axi_interconnect_i2c_1/M09_ARESETN] [get_bd_pins axi_interconnect_i2c_1/M10_ARESETN] \
  [get_bd_pins axi_interconnect_i2c_1/M11_ARESETN] [get_bd_pins axi_interconnect_i2c_1/M12_ARESETN] \
  [get_bd_pins axi_interconnect_i2c_1/M13_ARESETN] [get_bd_pins axi_interconnect_i2c_1/M14_ARESETN] \
  [get_bd_pins axi_interconnect_i2c_1/M15_ARESETN] [get_bd_pins axi_interconnect_xdma_bypass/ARESETN] \
  [get_bd_pins axi_interconnect_xdma_bypass/S00_ARESETN] [get_bd_pins axi_interconnect_xdma_bypass/M00_ARESETN] \
  [get_bd_pins axi_interconnect_xdma_bypass/M01_ARESETN] [get_bd_pins axi_interconnect_xdma_bypass/M02_ARESETN] \
  [get_bd_pins axi_interconnect_xdma_bypass/M03_ARESETN] [get_bd_pins axi_interconnect_xdma_bypass/M04_ARESETN] \
  [get_bd_pins axi_interconnect_xdma_bypass/M05_ARESETN] [get_bd_pins axi_interconnect_xdma_bypass/M06_ARESETN] \
  [get_bd_pins axi_interconnect_xdma_bypass/M07_ARESETN] [get_bd_pins axi_interconnect_xdma_bypass/M08_ARESETN] \
  [get_bd_pins axi_interconnect_xdma_bypass/M09_ARESETN] [get_bd_pins axi_interconnect_xdma_bypass/M10_ARESETN] \
  [get_bd_pins axi_interconnect_xdma_bypass/M11_ARESETN] [get_bd_pins axi_quad_spi_prom/s_axi_aresetn] \
  [get_bd_pins axi_timer_0/s_axi_aresetn] [get_bd_pins axi_uartlite_0/s_axi_aresetn] [get_bd_pins lbx8_c2p_buf/s_axi_aresetn] \
  [get_bd_pins microblaze_0_axi_intc/s_axi_aresetn] [get_bd_pins microblaze_0_axi_periph/ARESETN] \
  [get_bd_pins microblaze_0_axi_periph/S00_ARESETN] [get_bd_pins microblaze_0_axi_periph/M00_ARESETN] \
  [get_bd_pins microblaze_0_axi_periph/M01_ARESETN] [get_bd_pins microblaze_0_axi_periph/M02_ARESETN] \
  [get_bd_pins microblaze_0_axi_periph/M03_ARESETN] [get_bd_pins microblaze_0_axi_periph/M04_ARESETN] \
  [get_bd_pins microblaze_0_axi_periph/M05_ARESETN] [get_bd_pins microblaze_0_axi_periph/M06_ARESETN] \
  [get_bd_pins microblaze_0_axi_periph/M07_ARESETN] [get_bd_pins axi_bram_ctrl_all_sts/s_axi_aresetn] \
  [get_bd_pins board_info_0/s00_axi_aresetn]
connect_bd_net -net slot_id_0_1 [get_bd_ports slot_id_0] [get_bd_pins board_info_0/slot_id]
connect_bd_net -net sys_rst_n_0_1 [get_bd_ports perstn] [get_bd_pins xdma_0/sys_rst_n]
